# EAGLE design item_2022_Motherboard_04_V8 (EAGLE 7.7.0)

## Sheet 1 of 3
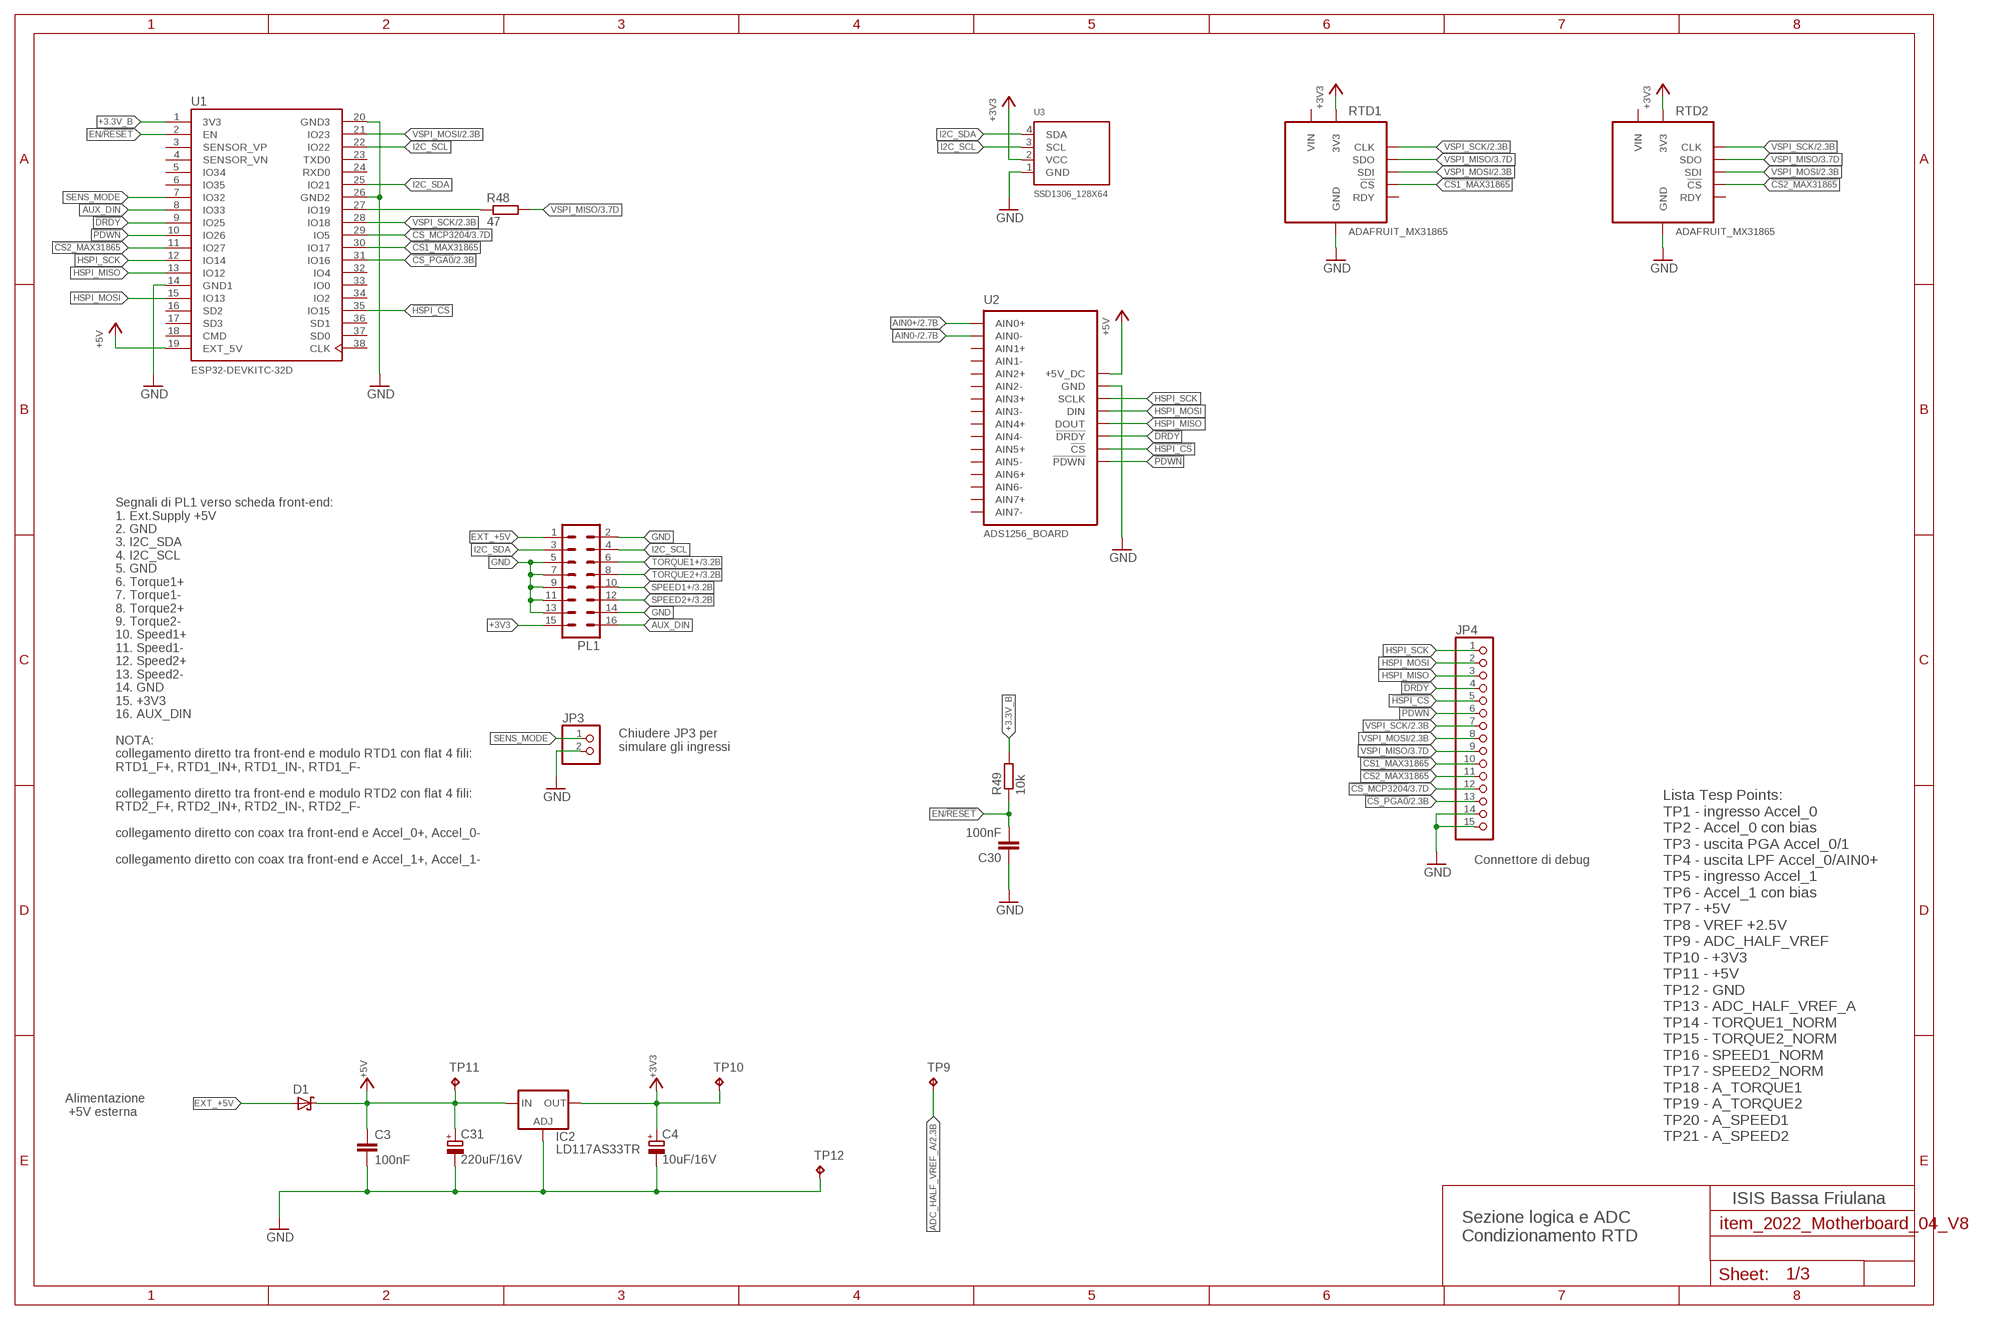
[diagram p0: schematic, sheet 1]

### Parts
C3  100nF  C-EUC0805K  [C0805K]
C4  10uF/16V  CPOL-EUE2.5-6  [E2,5-6]
C30  100nF  C-EUC0805  [C0805]
C31  220uF/16V  CPOL-EUE3.5-10  [E3,5-10]
D1  SCHOTTKY-DIODEDO35-7  [DO35-7]
IC2  LD117AS33TR  [SOT223]
JP3  PINHD-1X2  [1X02]
JP4  PINHD-1X15  [1X15]
PL1  16H  [16H]
R48  47  R-EU_R0805  [R0805]
R49  10k  R-EU_R0805  [R0805]
RTD1  ADAFRUIT_MX31865  [ADAFRUIT_MAX31865]
RTD2  ADAFRUIT_MX31865  [ADAFRUIT_MAX31865]
TP9  TPTP16SQ  [TP16SQ]
TP10  TPTP16SQ  [TP16SQ]
TP11  TPTP16SQ  [TP16SQ]
TP12  TPTP14R  [TP14R]
U1  ESP32-DEVKITC-32D  [MODULE_ESP32-DEVKITC-32D]
U2  ADS1256_BOARD  [ADS1256_BOARD]
U3  SSD1306_128X64  [128X64]

### Nets
!CS1_MAX31865! [digital]: JP4.10 RTD1.P7(!CS!) U1.30(IO17)
!CS2_MAX31865! [digital]: JP4.11 RTD2.P7(!CS!) U1.11(IO27)
!CS_MCP3204! [digital]: JP4.12 U1.29(IO5) ; also sheet 3
!CS_PGA0! [digital]: JP4.13 U1.31(IO16) ; also sheet 2
!DRDY! [digital]: JP4.4 U1.9(IO25) U2.!DRDY!
!HSPI_CS! [digital]: JP4.5 U1.35(IO15) U2.!CS!
!PDWN! [digital]: JP4.6 U1.10(IO26) U2.PDWN(!PDWN!)
+3.3V_B: R49.2 U1.1(3V3)
+3V3 [supply3V3]: C4.+ IC2.4(OUT) PL1.15 RTD1.P3(3V3) RTD2.P3(3V3) TP10.TP U3.2(VCC) ; also sheet 2,3
+5V [supply5V]: C3.1 C31.+ D1.C IC2.3(IN) TP11.TP U1.19(EXT_5V) U2.5V_DC(+5V_DC) ; also sheet 2,3
ADC_HALF_VREF_A [supply]: TP9.TP ; also sheet 2,3
AIN0+ [analog]: U2.AIN0+ ; also sheet 2
AIN0- [analog]: U2.AIN0- ; also sheet 2
AUX_DIN [digital]: PL1.16 U1.8(IO33)
EN/!RESET!: C30.2 R49.1 U1.2(EN)
EXT_+5V [supply5V]: D1.A PL1.1
GND [supply]: C3.2 C4.- C30.1 C31.- IC2.1(ADJ) JP3.2 JP4.14 JP4.15 PL1.2 PL1.5 PL1.7 PL1.9 PL1.11 PL1.13 PL1.14 RTD1.P2(GND) RTD2.P2(GND) TP12.TP U1.14(GND1) U1.20(GND3) U1.26(GND2) U2.GND U3.1(GND) ; also sheet 2,3
HSPI_MISO [digital]: JP4.3 U1.13(IO12) U2.DOUT
HSPI_MOSI [digital]: JP4.2 U1.15(IO13) U2.DIN
HSPI_SCK [digital]: JP4.1 U1.12(IO14) U2.SCLK
I2C_SCL [digital]: PL1.4 U1.22(IO22) U3.3(SCL)
I2C_SDA [digital]: PL1.3 U1.25(IO21) U3.4(SDA)
N$40: R48.1 U1.27(IO19)
SENS_MODE [digital]: JP3.1 U1.7(IO32)
SPEED1+ [analog]: PL1.10 ; also sheet 3
SPEED2+ [analog]: PL1.12 ; also sheet 3
TORQUE1+ [analog]: PL1.6 ; also sheet 3
TORQUE2+ [analog]: PL1.8 ; also sheet 3
VSPI_MISO [digital]: JP4.9 R48.2 RTD1.P5(SDO) RTD2.P5(SDO) ; also sheet 3
VSPI_MOSI [digital]: JP4.8 RTD1.P6(SDI) RTD2.P6(SDI) U1.21(IO23) ; also sheet 2,3
VSPI_SCK [digital]: JP4.7 RTD1.P4(CLK) RTD2.P4(CLK) U1.28(IO18) ; also sheet 2,3
Unconnected: RTD1.P8(RDY) RTD2.P8(RDY) U1.3(SENSOR_VP) U1.4(SENSOR_VN) U1.5(IO34) U1.6(IO35) U1.16(SD2) U1.17(SD3) U1.18(CMD) U1.23(TXD0) U1.24(RXD0) U1.32(IO4) U1.33(IO0) U1.34(IO2) U1.36(SD1) U1.37(SD0) U1.38(CLK) U2.AIN1+ U2.AIN1- U2.AIN2+ U2.AIN2- U2.AIN3+ U2.AIN3- U2.AIN4+ U2.AIN4- U2.AIN5+ U2.AIN5- U2.AIN6+ U2.AIN6- U2.AIN7+ U2.AIN7-

### Notes on the sheet
- Chiudere JP3 per
  simulare gli ingressi
- Connettore di debug
- Segnali di PL1 verso scheda front-end:
  1. Ext.Supply +5V
  2. GND
  3. I2C_SDA
  4. I2C_SCL
  5. GND
  6. Torque1+
  7. Torque1-
  8. Torque2+
  9. Torque2-
  10. Speed1+
  11. Speed1-
  12. Speed2+
  13. Speed2-
  14. GND
  15. +3V3
  16. AUX_DIN
  
  NOTA:
  collegamento diretto tra front-end e modulo RTD1 con flat 4 fili:
  RTD1_F+, RTD1_IN+, RTD1_IN-, RTD1_F-
  
  collegamento diretto tra front-end e modulo RTD2 con flat 4 fili:
  RTD2_F+, RTD2_IN+, RTD2_IN-, RTD2_F-
  
  collegamento diretto con coax tra front-end e Accel_0+, Accel_0-
  
  collegamento diretto con coax tra front-end e Accel_1+, Accel_1-
- Alimentazione
   +5V esterna
- Lista Tesp Points:
  TP1 - ingresso Accel_0
  TP2 - Accel_0 con bias
  TP3 - uscita PGA Accel_0/1
  TP4 - uscita LPF Accel_0/AIN0+
  TP5 - ingresso Accel_1
  TP6 - Accel_1 con bias
  TP7 - +5V
  TP8 - VREF +2.5V
  TP9 - ADC_HALF_VREF
  TP10 - +3V3
  TP11 - +5V
  TP12 - GND
  TP13 - ADC_HALF_VREF_A
  TP14 - TORQUE1_NORM
  TP15 - TORQUE2_NORM
  TP16 - SPEED1_NORM
  TP17 - SPEED2_NORM
  TP18 - A_TORQUE1
  TP19 - A_TORQUE2
  TP20 - A_SPEED1
  TP21 - A_SPEED2
- ISIS Bassa Friulana
- Sezione logica e ADC
  Condizionamento RTD

## Sheet 2 of 3
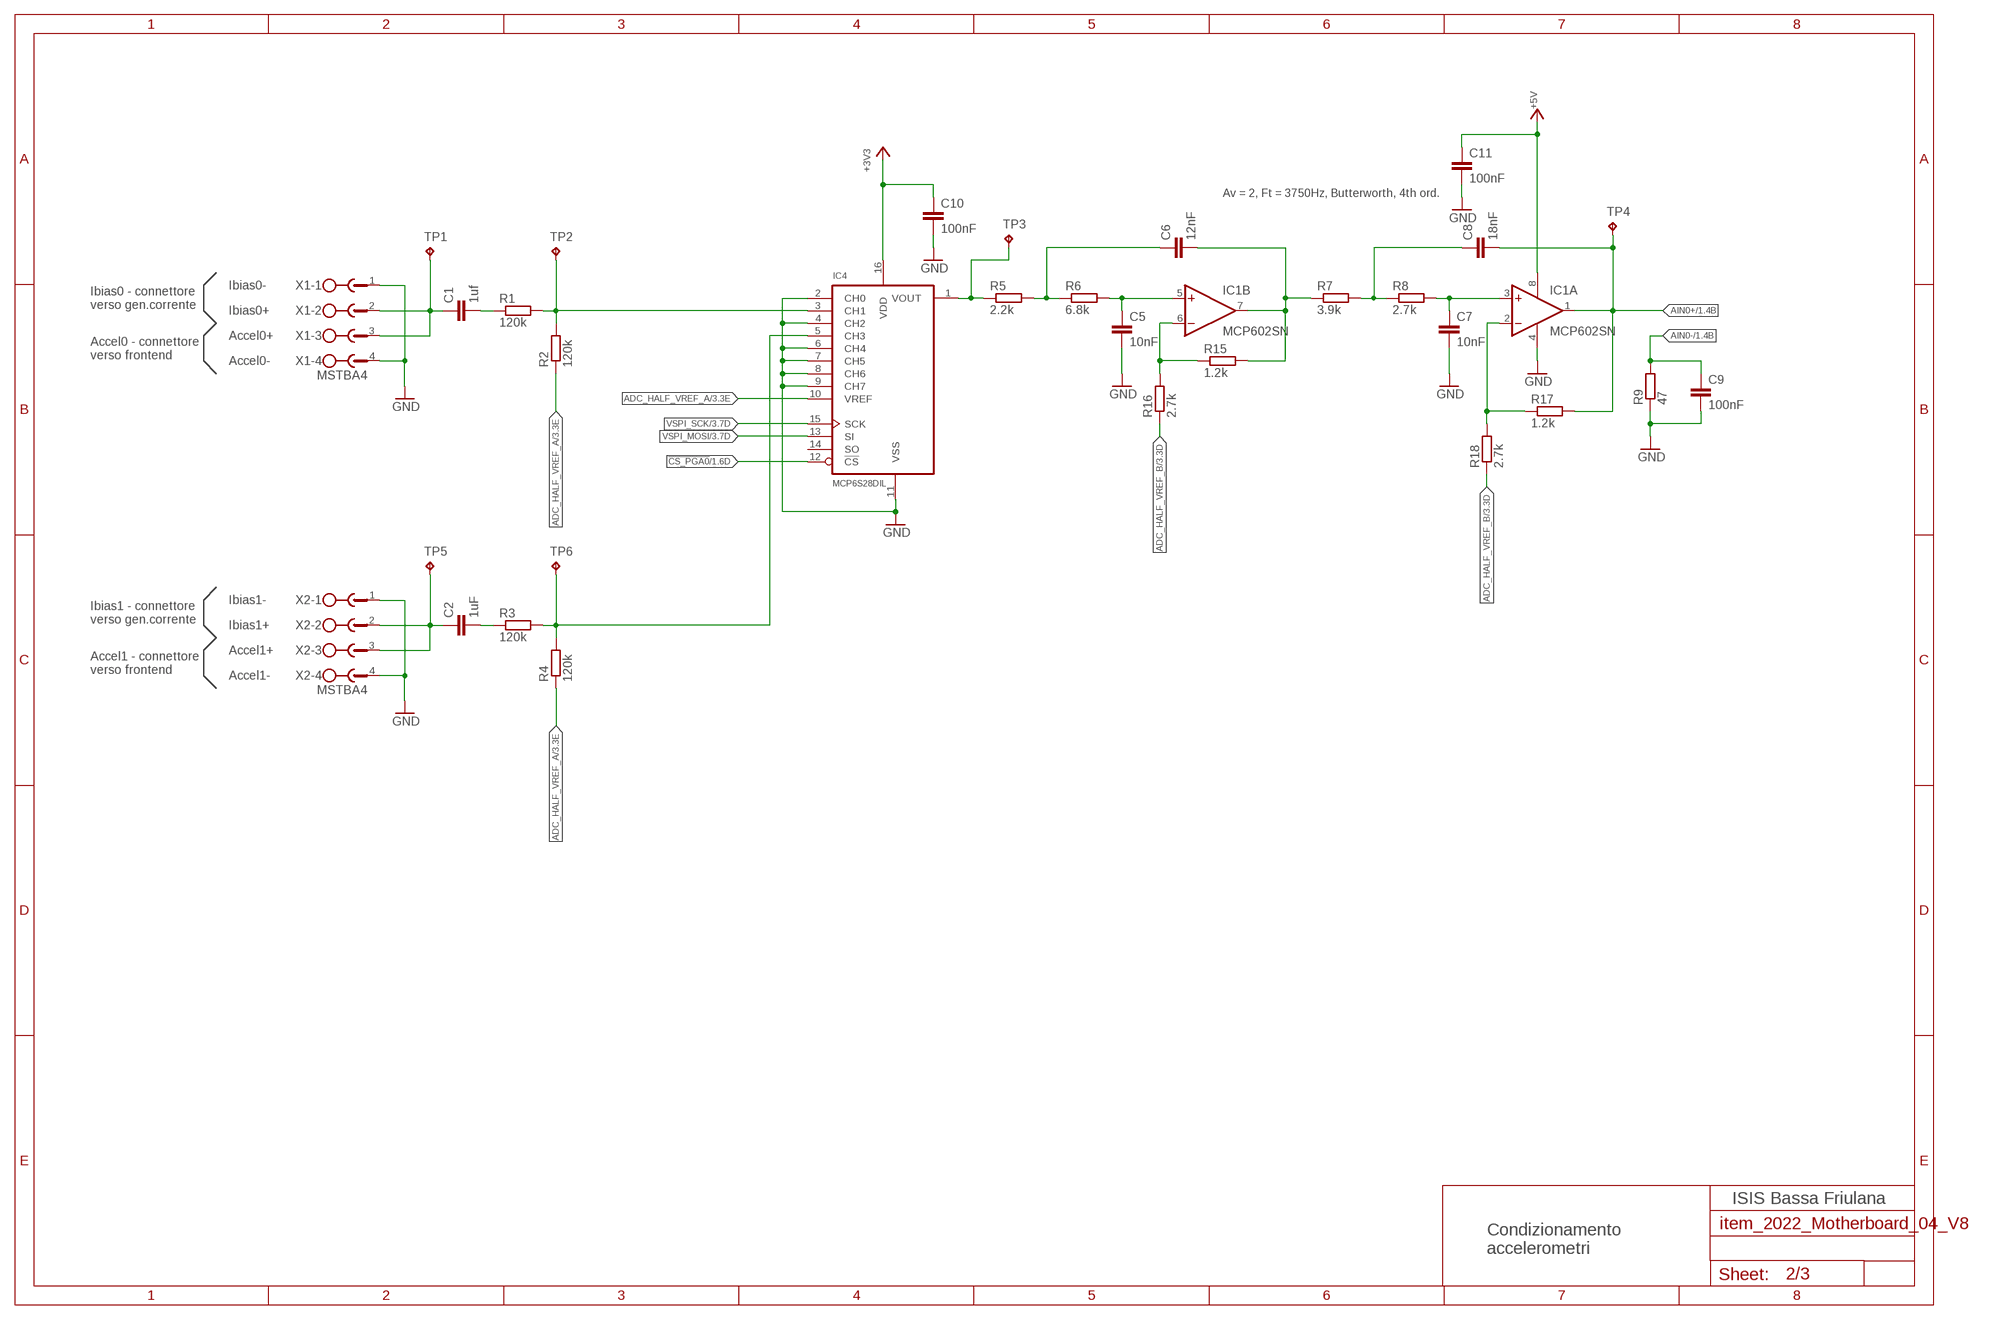
[diagram p1: schematic, sheet 2]

### Parts
C1  1uf  C-EUC1206  [C1206]
C2  1uF  C-EUC1206  [C1206]
C5  10nF  C-EUC0805K  [C0805K]
C6  12nF  C-EUC0805K  [C0805K]
C7  10nF  C-EUC0805K  [C0805K]
C8  18nF  C-EUC0805K  [C0805K]
C9  100nF  C-EUC0805K  [C0805K]
C10  100nF  C-EUC0805K  [C0805K]
C11  100nF  C-EUC0805K  [C0805K]
IC1  MCP602SN  [SO08]
IC4  MCP6S28DIL  [DIL16]
R1  120k  R-EU_R0805  [R0805]
R2  120k  R-EU_R0805  [R0805]
R3  120k  R-EU_R0805  [R0805]
R4  120k  R-EU_R0805  [R0805]
R5  2.2k  R-EU_R0805  [R0805]
R6  6.8k  R-EU_R0805  [R0805]
R7  3.9k  R-EU_R0805  [R0805]
R8  2.7k  R-EU_R0805  [R0805]
R9  47  R-EU_R0805  [R0805]
R15  1.2k  R-EU_R0805  [R0805]
R16  2.7k  R-EU_R0805  [R0805]
R17  1.2k  R-EU_R0805  [R0805]
R18  2.7k  R-EU_R0805  [R0805]
TP1  TPTP14R  [TP14R]
TP2  TPTP14R  [TP14R]
TP3  TPTP14R  [TP14R]
TP4  TPTP14R  [TP14R]
TP5  TPTP14R  [TP14R]
TP6  TPTP14R  [TP14R]
X1  MSTBA4  [MSTBA4]
X2  MSTBA4  [MSTBA4]

### Nets
!CS_PGA0! [digital]: IC4.12(!CS!) ; also sheet 1
+3V3 [supply3V3]: C10.1 IC4.16(VDD) ; also sheet 1,3
+5V [supply5V]: C11.1 IC1.8(P:V+) ; also sheet 1,3
ADC_HALF_VREF_A [supply]: IC4.10(VREF) R2.1 R4.1 ; also sheet 1,3
ADC_HALF_VREF_B: R16.1 R18.1 ; also sheet 3
AIN0+ [analog]: C8.2 IC1.1(A:OUT) R17.2 TP4.TP ; also sheet 1
AIN0- [analog]: C9.1 R9.2 ; also sheet 1
GND [supply]: C5.2 C7.2 C9.2 C10.2 C11.2 IC1.4(P:V-) IC4.2(CH0) IC4.4(CH2) IC4.6(CH4) IC4.7(CH5) IC4.8(CH6) IC4.9(CH7) IC4.11(VSS) R9.1 X1.1 X1.4 X2.1 X2.4 ; also sheet 1,3
N$2 [analog]: C1.1 TP1.TP X1.2 X1.3
N$3 [analog]: C2.1 TP5.TP X2.2 X2.3
N$4 [analog]: IC4.3(CH1) R1.2 R2.2 TP2.TP
N$5 [analog]: IC4.1(VOUT) R5.1 TP3.TP
N$6 [analog]: C1.2 R1.1
N$7: C2.2 R3.1
N$8 [analog]: IC1.6(B:-IN) R15.1 R16.2
N$9 [analog]: C6.1 R5.2 R6.1
N$10 [analog]: C5.1 IC1.5(B:+IN) R6.2
N$11 [analog]: C6.2 IC1.7(B:OUT) R7.1 R15.2
N$12 [analog]: C8.1 R7.2 R8.1
N$13 [analog]: C7.1 IC1.3(A:+IN) R8.2
N$14 [analog]: IC4.5(CH3) R3.2 R4.2 TP6.TP
N$21 [analog]: IC1.2(A:-IN) R17.1 R18.2
VSPI_MOSI [digital]: IC4.13(SI) ; also sheet 1,3
VSPI_SCK [digital]: IC4.15(SCK) ; also sheet 1,3
Unconnected: IC4.14(SO)

### Notes on the sheet
- Av = 2, Ft = 3750Hz, Butterworth, 4th ord.
- Ibias0-
- Ibias0 - connettore 
  verso gen.corrente
- Ibias0+
- Accel0+
- Accel0 - connettore 
  verso frontend
- Accel0-
- Ibias1-
- Ibias1 - connettore 
  verso gen.corrente
- Ibias1+
- Accel1+
- Accel1 - connettore 
  verso frontend
- Accel1-
- ISIS Bassa Friulana
- Condizionamento
  accelerometri

## Sheet 3 of 3
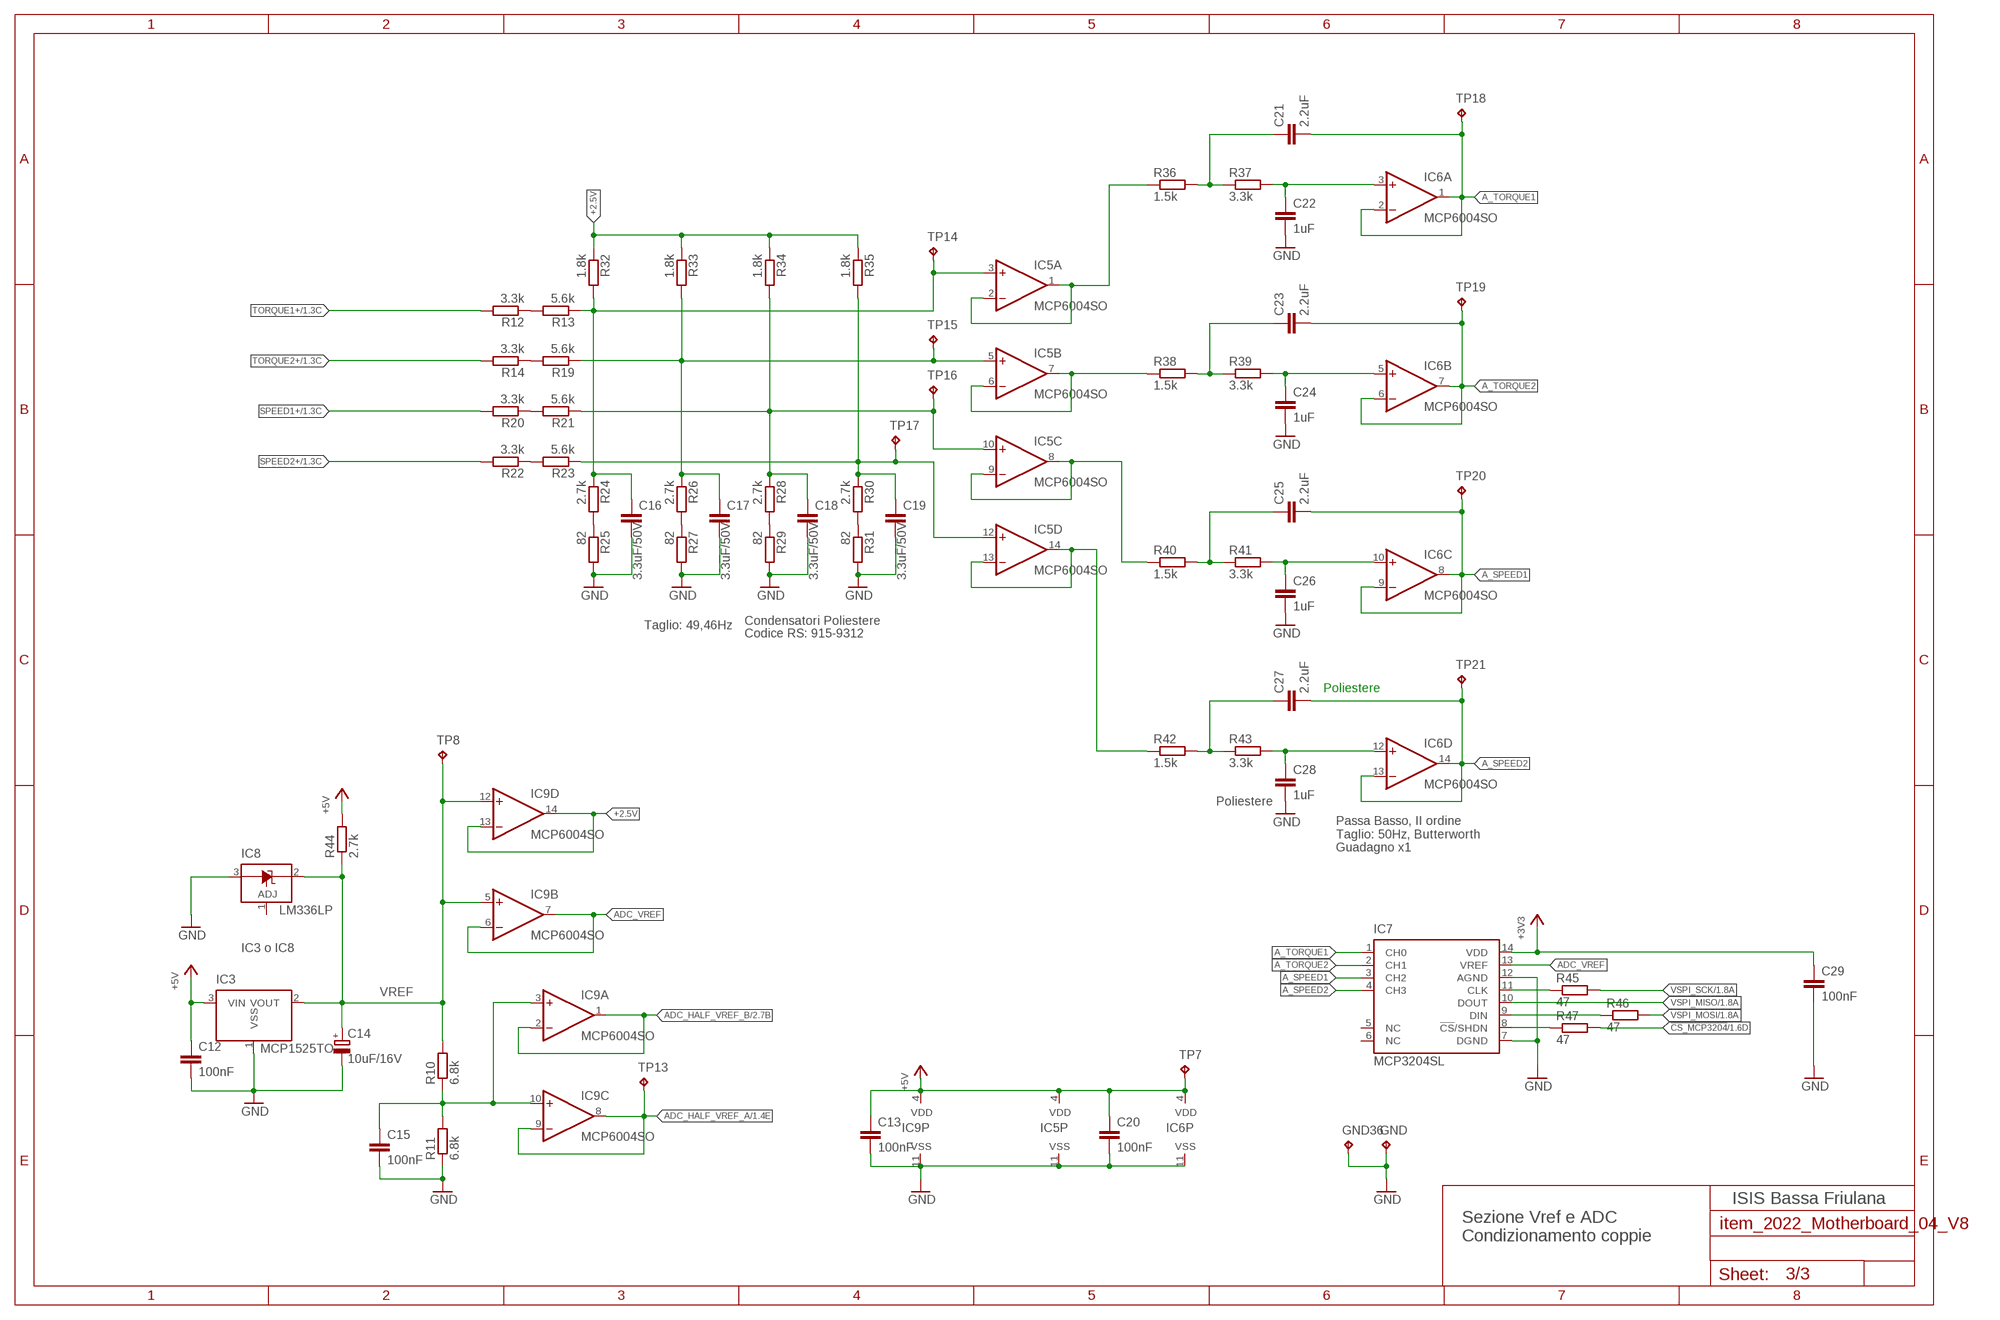
[diagram p2: schematic, sheet 3]

### Parts
C12  100nF  C-EUC0805  [C0805]
C13  100nF  C-EUC0805  [C0805]
C14  10uF/16V  CPOL-EUE2.5-6  [E2,5-6]
C15  100nF  C-EUC0805  [C0805]
C16  3.3uF/50V  C-EUC0805  [C0805]
C17  3.3uF/50V  C-EUC0805  [C0805]
C18  3.3uF/50V  C-EUC0805  [C0805]
C19  3.3uF/50V  C-EUC0805  [C0805]
C20  100nF  C-EUC0805  [C0805]
C21  2.2uF  C-EUC0805  [C0805]
C22  1uF  C-EUC0805  [C0805]
C23  2.2uF  C-EUC0805  [C0805]
C24  1uF  C-EUC0805  [C0805]
C25  2.2uF  C-EUC0805  [C0805]
C26  1uF  C-EUC0805  [C0805]
C27  2.2uF  C-EUC0805  [C0805]
C28  1uF  C-EUC0805  [C0805]
C29  100nF  C-EUC0805  [C0805]
GND  TPTP18SQ  [TP18SQ]
GND36  TPTP18SQ  [TP18SQ]
IC3  MCP1525TO  [TO92]
IC5  MCP6004SO  [SO14]
IC6  MCP6004SO  [SO14]
IC7  MCP3204SL  [SO14]
IC8  LM336LP  [TO92]
IC9  MCP6004SO  [SO14]
R10  6.8k  R-EU_R0805  [R0805]
R11  6.8k  R-EU_R0805  [R0805]
R12  3.3k  R-EU_R0805  [R0805]
R13  5.6k  R-EU_R0805  [R0805]
R14  3.3k  R-EU_R0805  [R0805]
R19  5.6k  R-EU_R0805  [R0805]
R20  3.3k  R-EU_M0805  [M0805]
R21  5.6k  R-EU_R0805  [R0805]
R22  3.3k  R-EU_R0805  [R0805]
R23  5.6k  R-EU_R0805  [R0805]
R24  2.7k  R-EU_R0805  [R0805]
R25  82  R-EU_R0805  [R0805]
R26  2.7k  R-EU_R0805  [R0805]
R27  82  R-EU_R0805  [R0805]
R28  2.7k  R-EU_R0805  [R0805]
R29  82  R-EU_R0805  [R0805]
R30  2.7k  R-EU_R0805  [R0805]
R31  82  R-EU_R0805  [R0805]
R32  1.8k  R-EU_R0805  [R0805]
R33  1.8k  R-EU_R0805  [R0805]
R34  1.8k  R-EU_R0805  [R0805]
R35  1.8k  R-EU_R0805  [R0805]
R36  1.5k  R-EU_R0805  [R0805]
R37  3.3k  R-EU_R0805  [R0805]
R38  1.5k  R-EU_R0805  [R0805]
R39  3.3k  R-EU_R0805  [R0805]
R40  1.5k  R-EU_R0805  [R0805]
R41  3.3k  R-EU_R0805  [R0805]
R42  1.5k  R-EU_R0805  [R0805]
R43  3.3k  R-EU_R0805  [R0805]
R44  2.7k  R-EU_R0805  [R0805]
R45  47  R-EU_R0805  [R0805]
R46  47  R-EU_R0805  [R0805]
R47  47  R-EU_R0805  [R0805]
TP7  TPTP16R  [TP16R]
TP8  TPTP16R  [TP16R]
TP13  TPTP16R  [TP16R]
TP14  TPTP14R  [TP14R]
TP15  TPTP14R  [TP14R]
TP16  TPTP14R  [TP14R]
TP17  TPTP14R  [TP14R]
TP18  TPTP14R  [TP14R]
TP19  TPTP14R  [TP14R]
TP20  TPTP14R  [TP14R]
TP21  TPTP14R  [TP14R]

### Nets
!CS_MCP3204! [digital]: R47.2 ; also sheet 1
+2.5V: IC9.13(D:-IN) IC9.14(D:OUT) R32.1 R33.1 R34.1 R35.1
+3V3 [supply3V3]: C29.1 IC7.14(VDD) ; also sheet 1,2
+5V [supply5V]: C12.1 C13.1 C20.1 IC3.3(VIN) IC5.4(P:VDD) IC6.4(P:VDD) IC9.4(P:VDD) R44.2 TP7.TP ; also sheet 1,2
A_SPEED1: C25.2 IC6.8(C:OUT) IC6.9(C:-IN) IC7.3(CH2) TP20.TP
A_SPEED2: C27.2 IC6.13(D:-IN) IC6.14(D:OUT) IC7.4(CH3) TP21.TP
A_TORQUE1: C21.2 IC6.1(A:OUT) IC6.2(A:-IN) IC7.1(CH0) TP18.TP
A_TORQUE2: C23.2 IC6.6(B:-IN) IC6.7(B:OUT) IC7.2(CH1) TP19.TP
ADC_HALF_VREF_A [supply]: IC9.8(C:OUT) IC9.9(C:-IN) TP13.TP ; also sheet 1,2
ADC_HALF_VREF_B: IC9.1(A:OUT) IC9.2(A:-IN) ; also sheet 2
ADC_VREF [supply]: IC7.13(VREF) IC9.6(B:-IN) IC9.7(B:OUT)
GND [supply]: C12.2 C13.2 C14.- C15.2 C16.2 C17.2 C18.2 C19.2 C20.2 C22.2 C24.2 C26.2 C28.2 C29.2 GND36.TP GND.TP IC3.1(VSS) IC5.11(P:VSS) IC6.11(P:VSS) IC7.7(DGND) IC7.12(AGND) IC8.3(A) IC9.11(P:VSS) R11.1 R25.2 R27.2 R29.2 R31.2 ; also sheet 1,2
N$1: C15.1 IC9.3(A:+IN) IC9.10(C:+IN) R10.1 R11.2
N$15: R12.1 R13.2
N$16: R14.1 R19.2
N$17: R20.1 R21.2
N$18: R22.1 R23.2
N$19: R24.2 R25.1
N$20: C16.1 IC5.3(A:+IN) R13.1 R24.1 R32.2 TP14.TP
N$22: R26.2 R27.1
N$23: R28.2 R29.1
N$24: R30.2 R31.1
N$25: C17.1 IC5.5(B:+IN) R19.1 R26.1 R33.2 TP15.TP
N$26: C18.1 IC5.10(C:+IN) R21.1 R28.1 R34.2 TP16.TP
N$27: C19.1 IC5.12(D:+IN) R23.1 R30.1 R35.2 TP17.TP
N$28: IC5.1(A:OUT) IC5.2(A:-IN) R36.1
N$29: IC5.6(B:-IN) IC5.7(B:OUT) R38.1
N$30: IC5.8(C:OUT) IC5.9(C:-IN) R40.1
N$31: IC5.13(D:-IN) IC5.14(D:OUT) R42.1
N$32: C21.1 R36.2 R37.1
N$33: C22.1 IC6.3(A:+IN) R37.2
N$34: C23.1 R38.2 R39.1
N$35: C24.1 IC6.5(B:+IN) R39.2
N$36: C25.1 R40.2 R41.1
N$37: C26.1 IC6.10(C:+IN) R41.2
N$38: C27.1 R42.2 R43.1
N$39: C28.1 IC6.12(D:+IN) R43.2
N$41: IC7.11(CLK) R45.1
N$42: IC7.9(DIN) R46.1
N$43: IC7.8(!CS!/SHDN) R47.1
SPEED1+ [analog]: R20.2 ; also sheet 1
SPEED2+ [analog]: R22.2 ; also sheet 1
TORQUE1+ [analog]: R12.2 ; also sheet 1
TORQUE2+ [analog]: R14.2 ; also sheet 1
VREF: C14.+ IC3.2(VOUT) IC8.2(C) IC9.5(B:+IN) IC9.12(D:+IN) R10.2 R44.1 TP8.TP
VSPI_MISO [digital]: IC7.10(DOUT) ; also sheet 1
VSPI_MOSI [digital]: R46.2 ; also sheet 1,2
VSPI_SCK [digital]: R45.2 ; also sheet 1,2
Unconnected: IC7.5(NC) IC7.6(NC) IC8.1(ADJ)

### Notes on the sheet
- Taglio: 49,46Hz | Condensatori Poliestere
- Codice RS: 915-9312
- Poliestere
- Poliestere
- Passa Basso, II ordine
  Taglio: 50Hz, Butterworth
  Guadagno x1
- IC3 o IC8
- ISIS Bassa Friulana
- Sezione Vref e ADC
  Condizionamento coppie

## Power pins joined to a net without a drawn wire
VIN: RTD1.P1(VIN) RTD2.P1(VIN)

## Library data of the parts
C1-C3 C5-C11 C30 = rcl:C-EU: CAPACITOR, European symbol
C4 C14 C31 = rcl@1:CPOL-EU: POLARIZED CAPACITOR, European symbol
C12 C13 C15 C20 C29 = rcl_LargePads:C-EU: CAPACITOR, European symbol
C16-C19 = rcl_LargePads:C-EU: CAPACITOR, European symbol; TME_EU: MKS2B043301H00KSSD
C21 C23 C25 C27 = rcl_LargePads:C-EU: CAPACITOR, European symbol; TME_EU: MKS2B042201F00KSSD
C22 C24 C26 C28 = rcl_LargePads:C-EU: CAPACITOR, European symbol; TME_EU: B32529C0105J189
D1 = diode:SCHOTTKY-DIODE: Schottky Diode
GND GND36 TP1-TP21 = testpad:TP: Test pad
IC1 = linear:MCP602: Single Op Amp 2.7V to 6.0V Single Supply CMOS Source: http://ww1.microchip.com/downloads/en/DeviceDoc/21314g.pdf
IC2 = v-reg:LD117A?*: Low drop fixed and adjustable positive voltage regulators 1 A Source: http://www.st.com/stonline/products/literature/ds/7194/ld1117axx.pdf
IC3 = MCP1525_MCP1541:MCP1525: MCP1525 - 2.5V Precision Voltage Reference
IC4 = microchip_opamp:MCP6S28: MCP6S28 Eight channels analog Programmable Gain Amplifier with SPI interface
IC5 IC6 IC9 = MCP6002_MCP6004:MCP6004: MCP6004 - 1 MHz, Low-Power quad Op Amp, Rail-to-Rail Input/Output, Supply Voltage: 1.8V to 6.0V
IC7 = MCP3204_MCP3208:MCP3204: MCP3204 - 2.7V 4-Channel 12-Bit A/D Converters with SPI Serial Interface
IC8 = linear:LM336: 2.5-V INTEGRATED REFERENCE CIRCUITS LM236 Source: http://focus.ti.com/lit/ds/symlink/lm336-2.5.pdf
JP3 = pinhead:PINHD-1X2: PIN HEADER
JP4 = pinhead:PINHD-1X15: PIN HEADER
PL1 = con-harting-h:16H: CONNECTOR; OC_FARNELL: unknown; OC_NEWARK: unknown
R1-R9 R15-R18 R44-R49 = rcl:R-EU_: RESISTOR, European symbol
R10-R14 R19-R43 = rcl_LargePads:R-EU_: RESISTOR, European symbol
RTD1 RTD2 = Adafruit_MAX31865_RTD:ADAFRUIT_MX31865: Adafruit MAX31865 - Adafruit MAX31865 RTD PT100 or PT1000 Amplifier
U1 = ESP32-DEVKITC-32D:ESP32-DEVKITC-32D: Eval Board For Esp-Wroom-32 Check prices <https://pricing.snapeda.com/parts/ESP32-DEVKITC-32D/Espressif%20Systems/view-part?ref=eda>; AVAILABILITY: Warning; DESCRIPTION: WiFi Development Tools (802.11) ESP32 General Development Kit, ESP32-WROOM-32D on the board; MF: Espressif Systems; MP: ESP32-DEVKITC-32D; PACKAGE: None; PRICE: None; PURCHASE-URL: https://pricing.snapeda.com/search/part/ESP32-DEVKITC-32D/?ref=eda
U2 = ADS1256:ADS1256_BOARD: Board 8 Channels - ADS1256 24bit
U3 = ssd1306oled:SSD1306_128X64: OLED Display Board 0.91" 128x64 White I2C - 4 Pins - SSD1306
X1 X2 = con-phoenix-508:MSTBA4: PHOENIX; MF: FARNELL; MPN: 1757268; OC_FARNELL: 3705195; OC_NEWARK: 71C4163

## Net classes
0 default: width 0.305 mm, drill 0.254 mm, clearance 0.305 mm
1 supply: width 0.406 mm, drill 0.305 mm, clearance 0.356 mm to class 0, clearance 0.356 mm
2 digital: width 0.203 mm, drill 0.254 mm, clearance 0.254 mm to class 0, clearance 0.305 mm to class 1, clearance 0.203 mm
3 analog: width 0.508 mm, drill 0.508 mm, clearance 0.406 mm to class 0, clearance 0.406 mm to class 1, clearance 0.406 mm to class 2, clearance 0.406 mm
4 supply5V: width 0.711 mm, drill 0.305 mm, clearance 0.406 mm to class 0, clearance 0.406 mm to class 1, clearance 0.406 mm to class 2, clearance 0.406 mm to class 3, clearance 0.406 mm
5 supply3V3: width 0.559 mm, drill 0.305 mm, clearance 0.356 mm to class 0, clearance 0.356 mm to class 1, clearance 0.356 mm to class 2, clearance 0.356 mm to class 3, clearance 0.356 mm to class 4, clearance 0.356 mm

## Board
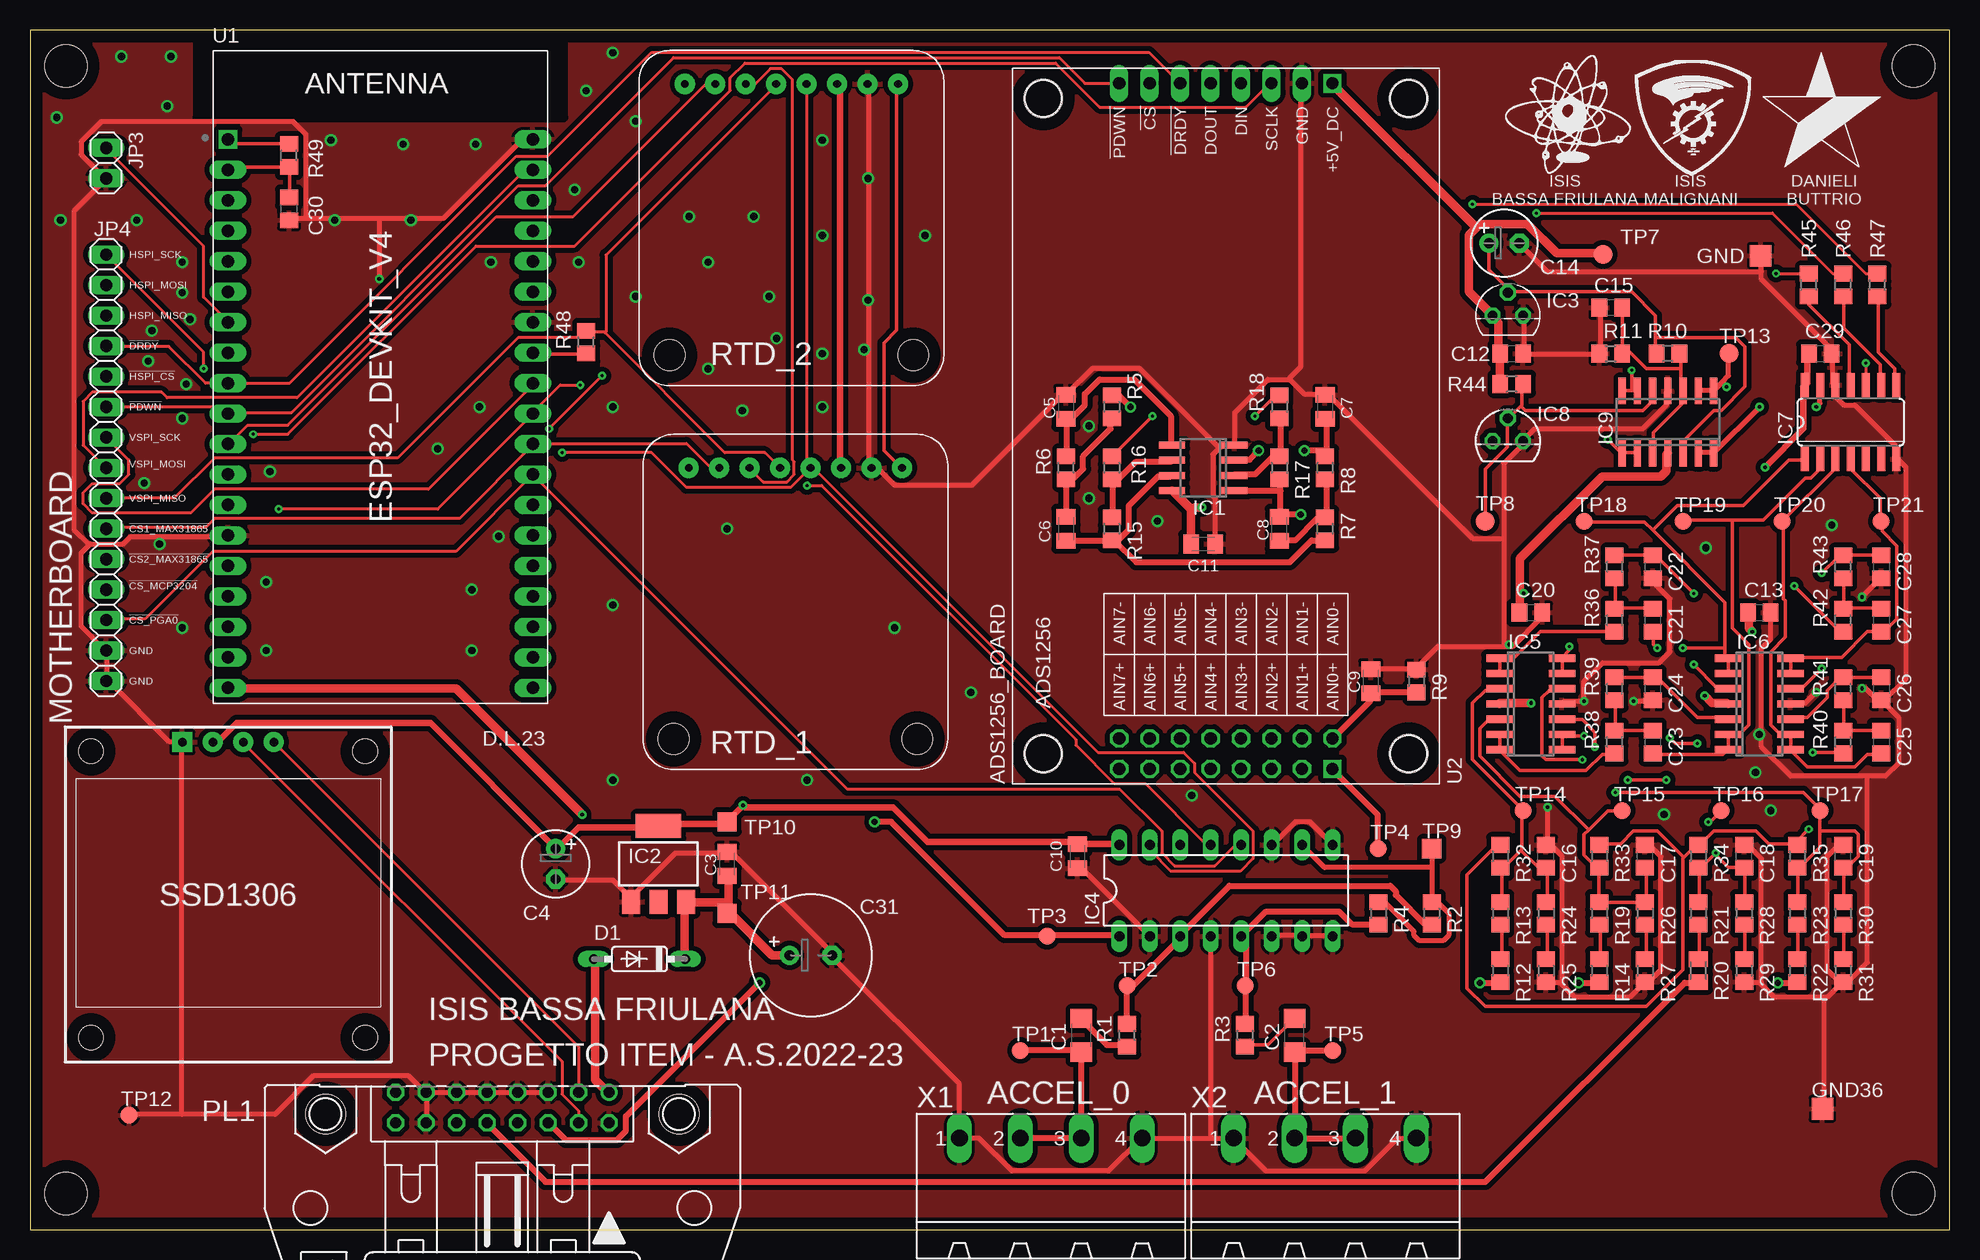
[diagram p3: board, top side]
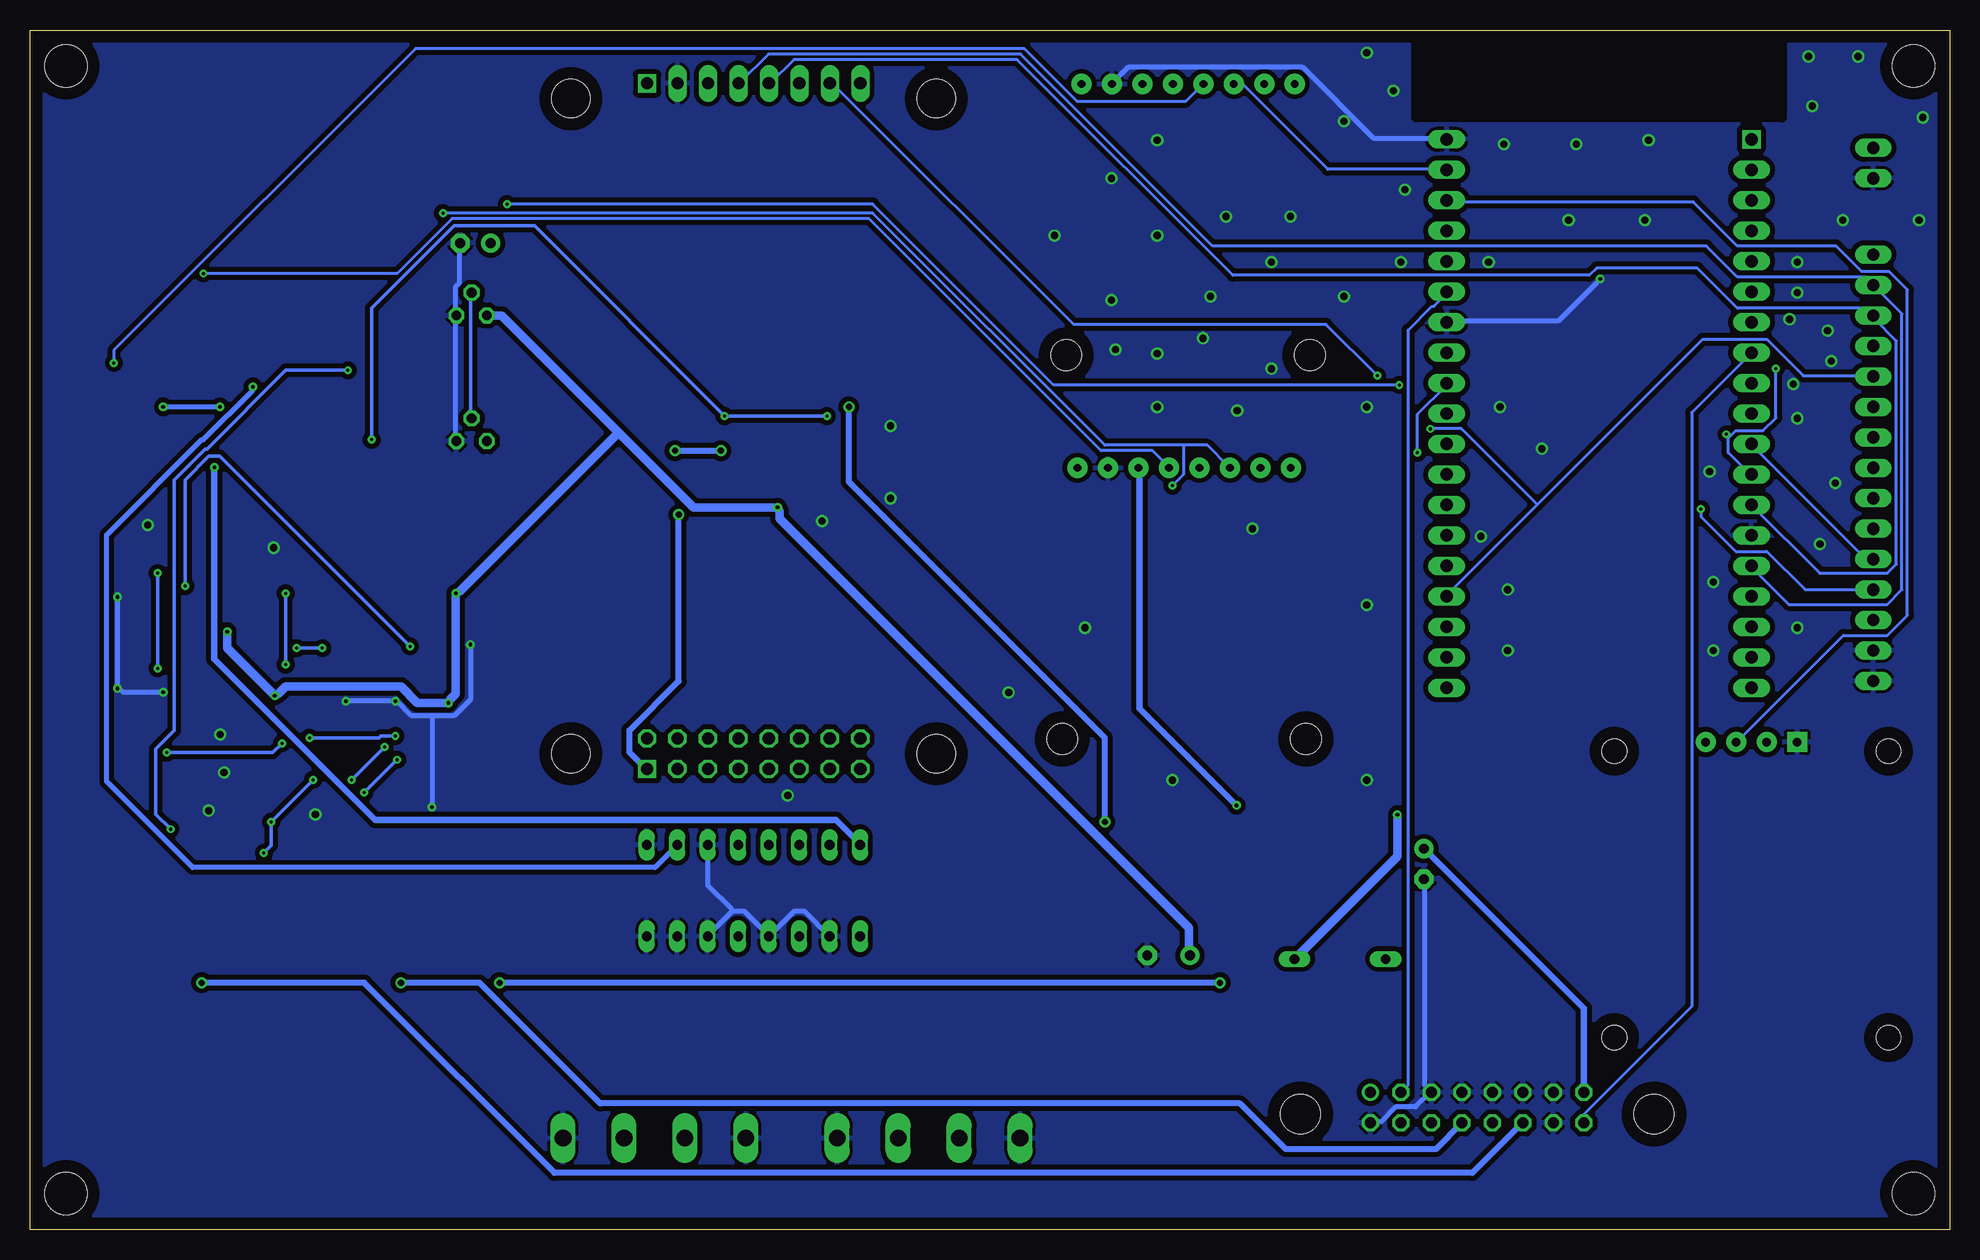
[diagram p4: board, bottom side, seen from below]

Size 160 x 100 mm. Coordinates in mm from the lower left corner, seen from the top.
Outline: 0,0 160,0 160,100 0,100 0,0
Copper layers (1*16): Top 0.035mm / dielectric 1.5mm / Bottom 0.035mm
Design rules "default *": minimum track width 10mil, minimum drill 0.2mm, track to track 8mil, track to pad 8mil, pad to pad 8mil, via to via 8mil, smd to smd 8mil, copper to edge 40mil, drill to drill 8mil, minimum pad ring 10mil, minimum via ring 8mil, stop-mask expansion 4mil, vias tented up to drill 0mil, thermal gap 10mil
Holes 3.5 mm at 157,97 157,3 3,97 3,3
Holes 3.2 mm at 84.45,39.67 114.92,39.67 114.92,94.28 84.45,94.28
tKeepout: area -1.3,99.1 to 161.3,101.6; area -1.3,-1.3 to 1.3,101.6; area -1.3,-1.3 to 161.3,1.3; area 158.8,-1.3 to 161.3,101.6
bKeepout: area -1.3,-1.3 to 1.3,100.3; area -1.3,-1.3 to 161.3,1.3; area 158.8,-1.3 to 161.3,101.6; area -1.3,99.1 to 161.3,101.6
tRestrict: area 14,92.7 to 44.5,100.3
bRestrict: area 14,92.7 to 44.5,100.3

### Footprints (pad centres in the part's own frame; a part is rotated, then mirrored left to right if it is on the bottom)
C1206 = smd 1.6 x 1.8: 1 -1.4,0; 2 1.4,0
C0805K = smd 1.3 x 1.6: 1 -1,0; 2 1,0
E2,5-6 = drill 0.813 pad 1.6: + -1.27,0 | drill 0.813 pad 1.6 octagon: - 1.27,0
C0805 = smd 1.3 x 1.5: 1 -0.95,0; 2 0.95,0
E3,5-10 = drill 0.813 pad 1.6: + -1.778,0 | drill 0.813 pad 1.6 octagon: - 1.778,0
DO35-7 = drill 0.813 long: A 3.81,0; C -3.81,0
TP18SQ = smd 1.8 x 1.8: TP 0,0
SO08 = smd 0.6 x 2.2: 1 -1.905,-2.6; 2 -0.635,-2.6; 3 0.635,-2.6; 4 1.905,-2.6; 5 1.905,2.6; 6 0.635,2.6; 7 -0.635,2.6; 8 -1.905,2.6
SOT223 = smd 1.5 x 2: 1 -2.3,-3.15; 2 0,-3.15; 3 2.3,-3.15 | smd 3.8 x 2: 4 0,3.15
TO92 = drill 0.813 octagon: 1 1.27,0; 2 0,1.905; 3 -1.27,0
DIL16 = drill 0.813 long: 1 -8.89,-3.81; 2 -6.35,-3.81; 3 -3.81,-3.81; 4 -1.27,-3.81; 5 1.27,-3.81; 6 3.81,-3.81; 7 6.35,-3.81; 8 8.89,-3.81; 9 8.89,3.81; 10 6.35,3.81; 11 3.81,3.81; 12 1.27,3.81; 13 -1.27,3.81; 14 -3.81,3.81; 15 -6.35,3.81; 16 -8.89,3.81
SO14 = smd 0.6 x 2.2: 1 -3.81,-2.6; 2 -2.54,-2.6; 3 -1.27,-2.6; 4 0,-2.6; 5 1.27,-2.6; 6 2.54,-2.6; 7 3.81,-2.6; 8 3.81,2.6; 9 2.54,2.6; 10 1.27,2.6; 11 0,2.6; 12 -1.27,2.6; 13 -2.54,2.6; 14 -3.81,2.6
SO14' = smd 0.66 x 2.032: 1 -3.81,-3.073; 2 -2.54,-3.073; 3 -1.27,-3.073; 4 0,-3.073; 5 1.27,-3.073; 6 2.54,-3.073; 7 3.81,-3.073; 8 3.81,3.073; 9 2.54,3.073; 10 1.27,3.073; 11 0,3.073; 12 -1.27,3.073; 13 -2.54,3.073; 14 -3.81,3.073
TO92' = drill 0.813 octagon: 1 -1.27,0; 2 0,1.905; 3 1.27,0
1X02 = drill 1.016 long: 1 -1.27,0; 2 1.27,0
1X15 = drill 1.016 long: 1 -17.78,0; 2 -15.24,0; 3 -12.7,0; 4 -10.16,0; 5 -7.62,0; 6 -5.08,0; 7 -2.54,0; 8 0,0; 9 2.54,0; 10 5.08,0; 11 7.62,0; 12 10.16,0; 13 12.7,0; 14 15.24,0; 15 17.78,0
16H = drill 0.914: 1 -8.89,-1.27 | drill 0.914 octagon: 2 -8.89,1.27; 3 -6.35,-1.27; 4 -6.35,1.27; 5 -3.81,-1.27; 6 -3.81,1.27; 7 -1.27,-1.27; 8 -1.27,1.27; 9 1.27,-1.27; 10 1.27,1.27; 11 3.81,-1.27; 12 3.81,1.27; 13 6.35,-1.27; 14 6.35,1.27; 15 8.89,-1.27; 16 8.89,1.27 | hole 3.302: -14.732,0.533; 14.732,0.533
R0805 = smd 1.3 x 1.5: 1 -0.95,0; 2 0.95,0
M0805 = smd 1.3 x 1.6: 1 -0.95,0; 2 0.95,0
ADAFRUIT_MAX31865 = drill 0.65 pad 1.676: P1 -8.89,-10.16; P2 -6.35,-10.16; P3 -3.81,-10.16; P4 -1.27,-10.16; P5 1.27,-10.16; P6 3.81,-10.16; P7 6.35,-10.16; P8 8.89,-10.16 | hole 2.54: -10.16,12.446; 10.16,12.446
TP14R = smd 1.4 x 1.4: TP 0,0
TP16R = smd 1.6 x 1.6: TP 0,0
TP16SQ = smd 1.6 x 1.6: TP 0,0
MODULE_ESP32-DEVKITC-32D = drill 1.04 square: 1 -12.7,19.76 | drill 1.04 long: 2 -12.7,17.22; 3 -12.7,14.68; 4 -12.7,12.14; 5 -12.7,9.6; 6 -12.7,7.06; 7 -12.7,4.52; 8 -12.7,1.98; 9 -12.7,-0.56; 10 -12.7,-3.1; 11 -12.7,-5.64; 12 -12.7,-8.18; 13 -12.7,-10.72; 14 -12.7,-13.26; 15 -12.7,-15.8; 16 -12.7,-18.34; 17 -12.7,-20.88; 18 -12.7,-23.42; 19 -12.7,-25.96; 20 12.7,19.76; 21 12.7,17.22; 22 12.7,14.68; 23 12.7,12.14; 24 12.7,9.6; 25 12.7,7.06; 26 12.7,4.52; 27 12.7,1.98; 28 12.7,-0.56; 29 12.7,-3.1; 30 12.7,-5.64; 31 12.7,-8.18; 32 12.7,-10.72; 33 12.7,-13.26; 34 12.7,-15.8; 35 12.7,-18.34; 36 12.7,-20.88; 37 12.7,-23.42; 38 12.7,-25.96
ADS1256_BOARD = drill 1.016 square: 5V_DC 27.94,7.62; AIN0+ -29.21,7.62 | drill 1.016 long: !CS! 27.94,-7.62; !DRDY! 27.94,-5.08; DIN 27.94,0; DOUT 27.94,-2.54; GND 27.94,5.08; PDWN 27.94,-10.16; SCLK 27.94,2.54 | drill 1.016 octagon: AIN0- -26.67,7.62; AIN1+ -29.21,5.08; AIN1- -26.67,5.08; AIN2+ -29.21,2.54; AIN2- -26.67,2.54; AIN3+ -29.21,0; AIN3- -26.67,0; AIN4+ -29.21,-2.54; AIN4- -26.67,-2.54; AIN5+ -29.21,-5.08; AIN5- -26.67,-5.08; AIN6+ -29.21,-7.62; AIN6- -26.67,-7.62; AIN7+ -29.21,-10.16; AIN7- -26.67,-10.16
128X64 = drill 0.7 pad 1.676 square: 1 -3.81,12.7 | drill 0.7 pad 1.676: 2 -1.27,12.7; 3 1.27,12.7; 4 3.81,12.7 | hole 2.032: -11.43,11.938; -11.43,-11.938; 11.43,11.938; 11.43,-11.938
MSTBA4 = drill 1.397 long: 1 -7.62,5.08; 2 -2.54,5.08; 3 2.54,5.08; 4 7.62,5.08

### Placement (x,y rotation side)
C1  87.63,16.19 90 top
C2  105.41,16.19 90 top
C3  58.1,30.48 90 top
C4  43.81,30.48 270 top
C5  86.36,68.58 90 top
C6  86.36,58.42 270 top
C7  107.95,68.58 90 top
C8  104.14,58.42 90 top
C9  111.76,45.72 90 top
C10  87.31,31.11 270 top
C11  97.79,57.15 0 top
C12  123.51,73.03 0 top
C13  144.15,51.44 0 top
C14  122.87,82.23 0 top
C15  131.76,76.83 180 top
C16  126.36,31.11 90 top
C17  134.62,31.11 90 top
C18  142.88,31.11 90 top
C19  151.13,31.11 90 top
C20  125.09,51.44 0 top
C21  135.25,50.8 270 top
C22  135.25,55.24 270 top
C23  135.25,40.64 270 top
C24  135.25,45.09 270 top
C25  154.31,40.64 270 top
C26  154.31,45.09 270 top
C27  154.31,50.8 270 top
C28  154.31,55.24 270 top
C29  149.22,73.03 0 top
C30  21.59,85.09 90 top
C31  65.09,22.86 0 top
D1  50.8,22.54 180 top
GND  144.26,81.18 0 top
GND36  149.4,10.06 0 top
IC1  97.79,63.5 90 top
IC2  52.39,30.48 0 top
IC3  123.19,76.2 0 top
IC4  99.69,28.26 0 top
IC5  125.09,43.81 270 top
IC6  144.15,43.81 270 top
IC7  MCP3204SL  [SO14']  151.76,67.31 0 top
IC8  LM336LP  [TO92']  123.19,65.72 0 top
IC9  136.53,67.31 0 top
JP3  6.35,88.9 270 top
JP4  6.35,63.5 270 top
PL1  39.37,10.16 180 top
R1  91.44,16.19 90 top
R2  116.84,26.35 270 top
R3  101.28,16.19 90 top
R4  112.39,26.35 270 top
R5  90.17,68.58 270 top
R6  86.36,63.5 90 top
R7  107.95,58.42 90 top
R8  107.95,63.5 90 top
R9  115.57,45.72 270 top
R10  136.53,73.03 180 top
R11  131.76,73.03 0 top
R12  122.56,21.59 270 top
R13  122.56,26.35 270 top
R14  130.81,21.59 270 top
R15  90.17,58.42 270 top
R16  90.17,63.5 270 top
R17  104.14,63.5 270 top
R18  104.14,68.58 270 top
R19  130.81,26.35 270 top
R20  139.06,21.59 270 top
R21  139.06,26.35 270 top
R22  147.32,21.59 270 top
R23  147.32,26.35 270 top
R24  126.36,26.35 270 top
R25  126.36,21.59 270 top
R26  134.62,26.35 270 top
R27  134.62,21.59 270 top
R28  142.88,26.35 270 top
R29  142.88,21.59 270 top
R30  151.13,26.35 270 top
R31  151.13,21.59 270 top
R32  122.56,31.11 270 top
R33  130.81,31.11 270 top
R34  139.06,31.11 270 top
R35  147.32,31.11 270 top
R36  132.08,50.8 90 top
R37  132.08,55.24 90 top
R38  132.08,40.64 90 top
R39  132.08,45.09 90 top
R40  151.13,40.64 90 top
R41  151.13,45.09 90 top
R42  151.13,50.8 90 top
R43  151.13,55.24 90 top
R44  123.51,70.48 180 top
R45  148.27,78.74 90 top
R46  151.13,78.74 90 top
R47  153.99,78.74 90 top
R48  46.35,73.98 90 top
R49  21.59,89.53 90 top
RTD1  63.8,53.34 180 top
RTD2  63.47,85.34 180 top
TP1  82.55,14.92 0 top
TP2  91.44,20.32 0 top
TP3  84.77,24.45 0 top
TP4  112.39,31.75 0 top
TP5  108.58,14.92 0 top
TP6  101.28,20.32 0 top
TP7  131.13,81.28 0 top
TP8  121.28,59.05 0 top
TP9  116.84,31.75 0 top
TP10  58.1,33.97 0 top
TP11  58.1,26.35 0 top
TP12  8.26,9.53 0 top
TP13  141.6,73.03 0 top
TP14  124.46,34.92 0 top
TP15  132.72,34.92 0 top
TP16  140.97,34.92 0 top
TP17  149.22,34.92 0 top
TP18  129.54,59.05 0 top
TP19  137.79,59.05 0 top
TP20  146.05,59.05 0 top
TP21  154.31,59.05 0 top
U1  29.21,71.12 0 top
U2  100.95,67.61 90 bottom
U3  16.51,27.94 0 top
U$1  [BASSA]  122.24,87.63 0 top
U$2  [UDINE]  133.35,87.63 0 top
U$3  [DANIELI]  144.15,88.58 0 top
X1  85.09,2.54 0 top
X2  107.95,2.54 0 top

### Tracks (layer width: path | path; a pad name or v marks a point on that pad's centre or on a via)
!CS1_MAX31865!
  Top 0.254: JP4.10 6.4,58.52 14.63,58.52 15.39,59.28 35.81,59.28 41.91,65.38 U1.30 41.91,65.53 54.71,65.53 56.69,63.55 57.3,63.55 RTD1.P7
!CS2_MAX31865!
  Top 0.254: RTD2.P7 57,95.4 56.24,95.4 45.26,84.43 38.86,84.43 21.49,67.06 18.14,67.06 16.61,65.53 U1.11
  Bottom 0.254: JP4.11 6.4,55.93 7.01,55.93 16.46,65.38 U1.11
!CS_MCP3204!  (via drill 0.25)
  Top 0.254: v120.24,85.5 147.22,85.5 153.01,79.7 153.92,79.7 R47.2 | v45.87,70.41 44.2,70.41 41.91,68.12 U1.29 41.91,67.97 33.98,60.05 v20.73,60.05
  Bottom 0.254: v120.24,85.5 89.76,85.5 74.68,70.41 v45.87,70.41 | JP4.12 12.04,53.34 15.24,56.54 17.83,56.54 20.73,59.44 v20.73,60.05
!CS_PGA0!
  Top 0.254: U1.31 68.12,36.73 90.83,36.73 94.34,33.22 94.34,31.39 95.4,30.33 98.75,30.33 100.43,32 100.89,32 IC4.12 | U1.31 35.51,56.54 15.24,56.54 9.6,50.9 6.4,50.9 JP4.13 | U1.31
!DRDY!
  Top 0.254: JP4.4 6.4,73.61 11.58,73.61 14.63,70.56 16.46,70.56 U1.9 16.61,70.56 21.64,70.56 40.54,89.46 43.13,89.46 51.82,98.15 93.27,98.15 U2.!DRDY!
!HSPI_CS!  (via drill 0.25)
  Top 0.254: v43.28,66.75 v47.7,71.17
  Bottom 0.254: 34.37,60.43 41.91,52.88 U1.35 | 34.37,60.43 20.57,74.22 15.24,74.22 12.19,71.17 6.4,71.17 JP4.5 | v47.7,71.17 51.97,75.44 73,75.44 92.96,95.4 93.27,95.4 U2.!CS! | v43.28,66.75 40.69,66.75 34.37,60.43
!PDWN!
  Top 0.254: JP4.6 16,68.58 16.46,68.12 U1.10 16.61,68.12 21.79,68.12 40.69,87.02 42.98,87.02 53.65,97.69 85.8,97.69 87.94,95.56 90.68,95.56 U2.PDWN
+2.5V  (via drill 0.25)
  Top 0.305: 133.5,69.95 133.96,69.95 IC9.13 | 133.5,69.95 132.74,69.95 IC9.14 | 137.85,31.01 138.99,32.16 R34.1 139.14,32 140.36,33.22 143.87,33.22 144.93,32.16 147.22,32.16 R35.1 147.22,32.31 v148.28,33.38 | 137.85,31.01 137.77,30.94 137.77,21.64 134.72,18.59 121.31,18.59 119.79,20.12 119.79,29.57 122.22,32 122.53,32 R32.1 | 137.85,31.01 135.64,33.22 133.66,33.22 132.59,32.16 130.91,32.16 R33.1 | v133.5,71.63 133.5,69.95
  Bottom 0.305: v133.5,71.63 138.68,71.63 145.24,65.08 145.39,65.08 147.98,62.48 147.98,41.6 149.5,40.08 149.5,34.59 v148.28,33.38
+3.3V_B
  Top 0.305: R49.2 21.49,90.53 16.92,90.53 16.61,90.83 U1.1
+3V3  (via drill 0.3)
  Top 0.559: C29.1 148.13,73 148.13,70.56 IC7.14 147.83,70.26 147.83,66.75 v144.63,63.55 | IC4.16 90.68,32.16 87.33,32.16 C10.1 87.17,32.31 74.83,32.31 71.93,35.2 59.59,35.2 v59.44,35.36 58.22,34.14 TP10.TP 58.06,33.83 52.58,33.83 52.43,33.68 IC2.4 52.12,33.53 45.72,33.53 44.04,31.85 C4.+ 43.74,31.85 33.38,42.22 17.22,42.22 15.7,40.69 15.24,40.69 U3.2 | RTD1.P3 67.51,63.55 67.51,95.25 67.36,95.4 RTD2.P3
  Bottom 0.559: v144.63,63.55 144.63,47.55 131.22,34.14 92.81,34.14 90.83,32.16 IC4.16 | PL1.15 30.48,18.44 43.74,31.7 C4.+ | v59.44,35.36 67.51,43.43 67.51,63.4 RTD1.P3
+5V  (via drill 0.3)
  Top 0.711: 58.22,27.28 58.22,29.41 C3.1 | 58.22,27.28 58.22,26.36 TP11.TP 58.52,26.21 61.87,22.86 C31.+ | 58.22,27.28 54.71,27.28 IC2.3 54.56,26.98 54.56,22.55 D1.C | v46.02,34.59 35.51,45.11 16.61,45.11 U1.19 | 124.21,53.03 124.21,55.93 131.06,62.79 135.94,62.79 136.4,63.25 136.4,64.62 IC9.4 | 124.21,53.03 124.21,51.51 C20.1 | v143.56,49.84 143.26,50.14 143.26,51.36 C13.1 | v139.6,44.5 140.21,43.89 141.43,43.89 IC6.4 | v125.12,43.89 122.53,43.89 IC5.4 | v124.51,53.03 124.21,53.03 | 96.77,60.05 96.77,57.15 C11.1 | 96.77,60.05 95.25,61.57 IC1.8 | R44.2 122.53,70.56 122.53,73 C12.1 122.38,73.3 122.38,75.59 122.07,75.89 IC3.3 119.94,78.18 119.94,82.91 120.55,83.52 | 120.55,83.52 120.85,83.82 124.82,83.82 127.25,81.38 131.06,81.38 TP7.TP | 120.55,83.52 108.66,95.4 U2.5V_DC | v97.69,60.2 97.08,60.2 96.77,60.05
  Bottom 0.711: v46.02,34.59 46.02,31.09 54.56,22.55 D1.C | v143.56,49.84 143.56,48.46 v139.6,44.5 139.29,44.65 138.68,45.26 129.08,45.26 127.71,43.89 v125.12,43.89 124.97,44.2 124.51,44.65 v124.51,53.03 124.21,53.19 110.95,66.45 | 110.95,66.45 120.7,76.2 IC3.3 | 110.95,66.45 104.7,60.2 v97.69,60.2 97.54,59.89 97.54,59.28 63.4,25.15 63.4,22.86 C31.+
A_SPEED1
  Top 0.305: IC7.3 150.42,64.16 150.42,63.4 146.15,59.13 TP20.TP 146.15,58.98 146.15,52.58 146.3,52.43 146.3,49.38 145.09,48.16 145.09,42.06 145.85,41.3 146.61,41.3 IC6.9 146.76,41.15 146.76,40.08 IC6.8 146.76,39.93 148.13,38.56 152.09,38.56 153.16,39.62 154.23,39.62 C25.2
A_SPEED2
  Top 0.305: IC7.4 151.79,64.16 151.79,63.4 154.23,60.96 154.23,59.13 TP21.TP 154.38,58.98 154.38,58.22 155.6,57 155.6,50.9 154.69,49.99 154.38,49.99 C27.2 154.23,49.84 153.16,49.84 151.03,47.7 146.76,47.7 IC6.14 146.76,47.55 146.76,46.48 IC6.13
A_TORQUE1  (via drill 0.25)
  Top 0.305: 135.25,58.29 141.28,52.27 141.28,48.46 | 135.25,58.29 134.57,58.98 129.54,58.98 TP18.TP | 141.28,48.46 141.28,47.85 141.43,47.7 IC6.1 141.58,47.55 141.58,46.48 IC6.2 | v135.64,48.46 135.33,48.77 135.33,49.84 C21.2 | 141.28,48.46 v137.77,48.46 | 135.25,58.29 137.31,60.35 142.8,60.35 146.61,64.16 147.83,64.16 IC7.1
  Bottom 0.305: v137.77,48.46 v135.64,48.46
A_TORQUE2
  Top 0.305: C23.2 135.33,39.62 141.12,39.62 141.43,39.93 IC6.7 141.58,40.08 141.58,41.15 IC6.6 141.73,41.15 142.34,41.15 143.26,42.06 143.26,48.77 141.88,50.14 141.88,59.13 | 141.88,59.13 144.47,59.13 147.98,62.64 148.44,62.64 149.2,63.4 149.2,64.16 IC7.2 | 141.88,59.13 137.92,59.13 TP19.TP
ADC_HALF_VREF_A  (via drill 0.3)
  Top 0.406: 141.05,70.64 140.36,69.95 IC9.8 140.21,69.95 139.14,69.95 IC9.9 | 141.05,70.64 141.58,71.17 141.58,73 TP13.TP | R4.1 112.47,27.28 112.93,27.28 115.37,24.84 115.37,24.54 115.82,24.08 117.81,24.08 118.26,24.54 118.26,26.36 117.35,27.28 116.89,27.28 R2.1 116.89,27.43 116.89,30.18 | 116.89,30.18 116.89,31.7 TP9.TP | 116.89,30.18 107.9,30.18 106.07,32 IC4.10 | v141.43,70.26 141.05,70.64
  Bottom 0.406: v141.43,70.26 141.43,69.95 145.54,65.84 145.69,65.84 153.62,57.91 153.62,37.34 146.46,30.18 107.9,30.18 106.07,32 IC4.10
ADC_HALF_VREF_B  (via drill 0.25)
  Top 0.305: IC9.2 133.96,64.77 132.74,64.77 IC9.1 132.59,64.77 v131.52,65.84 | v93.57,67.82 90.22,64.47 R16.1 | v102.11,67.82 103.78,69.49 104.09,69.49 R18.1
  Bottom 0.305: v93.57,67.82 v102.11,67.82 117.96,83.67 124.66,83.67 131.52,76.81 v131.52,65.84
ADC_VREF  (via drill 0.3)
  Top 0.406: v148.9,68.58 149.2,68.89 149.2,70.26 IC7.13 | v144.17,68.58 140.36,64.77 IC9.7 140.21,64.77 139.14,64.77 IC9.6
  Bottom 0.406: v144.17,68.58 v148.9,68.58
AIN0+  (via drill 0.51)
  Top 0.508: 104.24,61.57 104.24,59.44 C8.2 104.39,59.59 v105.92,59.59 | 104.24,61.57 104.24,62.48 R17.2 | 104.24,61.57 100.43,61.57 IC1.1 | TP4.TP 112.32,31.85 112.32,34.59 108.66,38.25 U2.AIN0+
  Bottom 0.508: v105.92,59.59 105.92,45.72 110.03,41.6 110.03,39.78 108.66,38.41 U2.AIN0+
AIN0-
  Top 0.508: R9.2 115.52,44.81 111.86,44.81 C9.1 111.71,44.5 111.71,44.04 108.66,41 U2.AIN0-
AUX_DIN
  Bottom 0.254: PL1.16 30.48,9.6 21.49,18.59 21.49,68.12 16.61,73 U1.8
EN/!RESET!
  Top 0.305: C30.2 21.64,86.11 21.64,88.54 R49.1 21.49,88.54 16.76,88.54 16.61,88.39 U1.2
EXT_+5V
  Top 0.711: D1.A 47.09,22.4 47.09,12.5 48.16,11.43 PL1.1
GND  (via drill 0.3, 0.6)
  Top 0.406: IC4.11 103.63,32.16 105.46,33.98 106.68,33.98 108.51,32.16 IC4.9 | IC4.6 103.63,24.54 105.92,24.54 IC4.7 106.22,24.54 108.51,24.54 IC4.8 | C10.2 87.33,30.02 87.78,30.02 93.27,24.54 IC4.2 | 98.45,7.62 X1.4 92.66,7.62 89.92,4.88 81.84,4.88 79.1,7.62 X1.1 77.42,7.77 77.42,12.19 66.9,22.71 C31.- 66.75,22.86 66.75,23.16 58.67,31.24 58.22,31.24 C3.2 58.06,31.39 53.8,31.39 50.14,27.74 50.14,27.43 IC2.1 49.99,27.74 48.62,29.11 43.89,29.11 C4.- | 98.45,7.62 X2.1 100.43,7.47 103.02,4.88 111.25,4.88 114,7.62 X2.4 | 98.45,7.62 98.45,24.38 IC4.4 | 5.03,57.15 7.77,57.15 8.38,57.76 16.46,57.76 U1.14 | 5.03,57.15 4.27,56.39 4.27,50.29 6.25,48.31 JP4.14 6.4,48.16 6.4,45.72 JP4.15 6.55,45.72 11.58,40.69 12.65,40.69 U3.1 12.65,40.54 12.65,9.6 | 12.65,9.6 20.42,9.6 23.62,12.8 31.55,12.8 32.92,11.43 PL1.13 | 12.65,9.6 8.38,9.6 TP12.TP | PL1.14 33.07,8.99 33.07,11.28 PL1.13 | PL1.13 PL1.11 PL1.9 PL1.7 PL1.5 | 153.16,37.8 154.69,37.8 155.75,38.86 155.75,42.67 154.38,44.04 C26.2 | 153.16,37.8 146.76,37.8 144.32,40.23 144.32,48.46 145.09,49.23 145.09,51.36 C13.2 | v152.71,52.73 154.23,54.25 C28.2 | v152.71,45.11 153.01,45.11 153.92,44.2 154.23,44.2 C26.2 | v148.9,44.81 147.98,43.89 146.76,43.89 IC6.11 | 144.17,20.57 142.95,20.57 R29.2 | 144.17,20.57 145.39,19.36 149.5,19.36 | 149.5,19.36 149.81,19.36 151.03,20.57 R31.2 | C18.2 142.95,32 143.26,32 144.32,30.94 144.32,20.57 144.17,20.57 | C19.2 151.03,32 150.72,32 149.81,31.09 149.81,21.64 150.88,20.57 R31.2 | 149.5,19.36 149.5,10.21 GND36.TP | 153.16,37.8 153.16,22.25 151.64,20.73 151.18,20.73 R31.2 | 144.32,79.86 144.32,79.25 150.11,73.46 150.11,73.15 C29.2 150.27,73 150.27,70.56 150.42,70.41 IC7.12 150.57,70.26 150.57,69.34 151.18,68.73 152.09,68.73 155.45,65.38 155.45,64.31 IC7.7 155.75,64.16 156.36,63.55 156.36,45.87 154.53,44.04 C26.2
  Top 0.406: 144.32,79.86 144.32,81.08 GND.TP | 127.56,20.57 126.49,20.57 R25.2 | 127.56,20.57 128.78,19.36 133.35,19.36 134.57,20.57 R27.2 134.72,20.73 135.03,20.73 135.94,21.64 135.94,31.09 135.03,32 134.72,32 C17.2 | 127.56,20.57 127.71,20.57 127.71,31.09 126.8,32 126.49,32 C16.2 126.49,32.16 v126.49,35.2 | v133.66,44.04 135.18,44.04 C24.2 | IC5.11 127.71,43.89 127.86,44.04 v129.54,44.04 129.54,45.72 131.06,47.24 135.79,47.24 136.7,48.16 136.7,52.58 135.33,53.95 135.33,54.25 C22.2 | C9.2 111.86,46.79 115.52,46.79 R9.1 115.67,46.94 117.35,48.62 122.83,48.62 | 122.83,48.62 123.29,48.62 | 123.29,48.62 123.6,48.62 126.03,51.05 126.03,51.36 C20.2 | C15.2 130.91,76.81 130.91,73.15 R11.1 130.76,73 124.66,73 C12.2 124.51,73.15 124.51,76.2 IC3.1 | IC9.11 136.4,69.8 136.4,68.73 134.42,66.75 125.42,66.75 124.51,65.84 IC8.3 124.51,65.53 122.83,63.86 122.83,57.61 | 122.83,57.61 122.83,48.62 | v123.29,48.77 123.29,48.62 | 144.32,79.86 126.49,79.86 124.21,82.14 C14.- | 29.11,84.28 34.44,84.28 41,90.83 41.91,90.83 U1.20 | 29.11,84.28 23.01,84.28 | 23.01,84.28 21.64,84.28 C30.1 | 23.01,84.28 23.01,91.29 21.95,92.35 5.94,92.35 4.27,90.68 4.27,89.61 6.25,87.63 JP3.2 6.25,87.48 3.66,84.89 3.66,58.37 4.88,57.15 5.03,57.15 | 29.11,84.28 v29.11,79.25 | 99.14,65.15 99.36,65.38 100.28,65.38 IC1.4 100.43,65.53 100.43,68.12 103.17,70.87 105,70.87 | 99.14,65.15 98.6,64.62 98.6,61.11 98.75,60.96 98.75,57.15 C11.2 | 99.14,65.15 92.51,71.78 88.54,71.78 86.41,69.65 C5.2 86.26,69.49 85.95,69.49 78.49,62.03 72.08,62.03 70.71,63.4 70.26,63.4 RTD1.P2 69.95,63.55 69.95,95.4 RTD2.P2 | 105,70.87 106.22,69.65 107.9,69.65 C7.2 108.05,69.49 108.36,69.49 120.24,57.61 122.83,57.61
  Top 0.406: U2.GND 105.92,95.4 105.92,71.93 105,71.02 105,70.87
  Bottom 0.406: IC4.2 93.42,24.54 95.4,26.52 96.32,26.52 98.3,24.54 IC4.4 98.45,24.54 100.43,26.52 101.5,26.52 | 101.5,26.52 103.48,24.54 IC4.6 | IC4.11 103.48,32 103.48,28.65 101.5,26.67 101.5,26.52 | PL1.2 48.16,8.99 47.4,8.99 46.18,10.21 44.5,10.21 43.28,11.43 PL1.5 43.28,11.58 43.74,12.04 43.74,29.11 C4.- | v152.71,52.73 v152.71,45.11 152.55,45.11 152.25,44.81 v148.9,44.81 | v133.66,44.04 v129.54,44.04 129.39,44.04 128.17,42.82 126.49,42.82 | C14.- 124.21,82.14 124.21,78.94 124.51,78.64 124.51,76.2 IC3.1 124.51,76.05 124.51,65.84 IC8.3 | 126.49,42.82 124.66,42.82 123.29,44.2 v123.29,48.77 | 126.49,42.82 v126.49,35.2 | v29.11,79.25 32.61,75.74 41.91,75.74 U1.26 | U1.20 41.91,90.98 48.01,90.98 53.95,96.93 68.43,96.93 69.8,95.56 RTD2.P2
  other vias: 66.04,68.58 59.37,68.26 48.58,68.58 48.58,52.07 48.58,37.47 64.77,37.47 78.42,44.77 37.47,68.58 33.97,65.09 19.68,53.98 12.7,50.16 19.68,48.26 36.83,53.34 36.83,48.26 58.1,58.42 72.07,50.16 20,63.18 10.79,57.15 25.4,84.14 31.75,84.14 38.42,80.64 45.72,80.64 56.52,80.64 54.93,84.45 60.33,84.45 50.48,77.79 61.59,77.79 69.85,77.47 74.61,82.87 69.85,87.63 7.62,97.79 11.75,97.79 11.43,93.66 2.22,92.71 2.54,84.14 8.89,84.14 25.08,90.81 31.11,90.49 37.15,90.49 45.4,86.68 50.48,92.39 46.35,94.93 48.58,98.11 13.34,75.88 12.7,78.11 12.7,80.64 10.16,74.93 9.84,72.39 13.02,70.48 12.7,67.63 9.53,62.23 39.05,57.78 56.52,71.75 62.23,74.3 66.04,73.03 69.53,73.34 66.04,82.87 66.04,90.81 88.27,66.99 88.27,60.96 93.98,59.05 150.18,58.74 139.7,56.83 96.84,36.2 136.21,34.61 143.83,38.1 144.15,41.27 145.1,34.92
  pour Bottom (isolate 0.406): -2.54,102.87 162.88,102.87 162.88,-3.49 -2.54,-3.49
  pour Top (isolate 0.406): -4.45,103.19 162.56,103.19 162.56,-2.86 -4.45,-2.86
HSPI_MISO
  Bottom 0.254: U1.13 16.46,60.35 10.82,54.71 5.18,54.71 4.42,55.47 4.42,74.07 6.25,75.89 6.25,76.2 JP4.3 6.4,76.2 7.01,76.81 17.68,76.81 21.03,80.16 29.41,80.16 30.02,79.55 59.74,79.55 77.72,97.54 96.32,97.54 98.3,95.56 U2.DOUT
HSPI_MOSI
  Bottom 0.254: U1.15 16.46,55.17 13.41,52.12 5.18,52.12 3.96,53.34 3.96,76.35 JP4.2 7.01,79.4 17.68,79.4 20.27,81.99 61.42,81.99 77.42,97.99 98.45,97.99 100.89,95.56 U2.DIN
HSPI_SCK  (via drill 0.25)
  Top 0.254: JP4.1 14.48,73.15 v14.48,71.78 | v18.59,66.29 21.49,66.29 37.19,81.99 45.41,81.99 58.37,94.94 58.37,96.01 59.59,97.23 85.5,97.23 89.15,93.57 101.35,93.57 103.17,95.4 103.48,95.4 U2.SCLK
  Bottom 0.254: v14.48,71.78 14.48,67.67 15.54,66.6 17.83,66.6 18.36,66.06 | 18.36,66.06 18.44,65.99 18.44,64.77 16.61,62.94 U1.12 | 18.36,66.06 v18.59,66.29
I2C_SCL
  Top 0.254: PL1.4 45.72,9.91 44.35,11.28 44.35,14.02 17.83,40.54 U3.3
  Bottom 0.254: U1.22 41.91,85.65 21.34,85.65 17.68,81.99 9.45,81.99 7.32,79.86 5.03,79.86 3.5,78.33 3.5,51.21 5.18,49.53 8.84,49.53 17.68,40.69 U3.3
I2C_SDA
  Top 0.254: PL1.3 45.72,15.24 U3.4
  Bottom 0.254: PL1.3 45.11,12.04 45.11,74.98 43.13,76.96 42.98,76.96 41.91,78.03 U1.25
N$1
  Top 0.305: C15.1 132.74,76.81 132.74,73.15 R11.2 132.89,73.15 133.35,73.15 134.72,71.78 137.62,71.78 | 137.62,71.78 137.62,70.1 137.77,69.95 IC9.10 137.77,69.8 137.77,68.89 135.33,66.45 135.33,64.77 IC9.3 | 137.62,71.78 137.62,73 R10.1
N$2
  Top 0.508: TP1.TP 82.6,14.94 87.63,14.94 C1.1 X1.3 X1.2
N$3
  Top 0.508: TP5.TP 108.51,14.94 105.46,14.94 C2.1 105.46,14.63 105.46,7.62 X2.2 X2.3
N$4
  Top 0.508: R1.2 TP2.TP 91.59,20.42 92.05,20.42 95.86,24.23 IC4.3 95.86,24.54 99.97,28.65 113.39,28.65 113.84,28.19 113.84,27.89 116.28,25.45 116.74,25.45 R2.2
N$5  (via drill 0.51)
  Top 0.508: IC4.1 90.68,24.54 84.89,24.54 TP3.TP 84.58,24.54 81.23,24.54 71.78,33.98 v70.41,33.98 | v91.75,68.58 90.83,69.49 90.22,69.49 R5.1
  Bottom 0.508: v91.75,68.58 91.75,62.33 70.41,41 v70.41,33.98
N$6
  Top 0.508: R1.1 91.44,15.39 89.76,15.39 87.63,17.53 C1.2
N$7
  Top 0.305: R3.1 101.35,15.39 103.17,15.39 105.31,17.53 C2.2
N$8
  Top 0.508: R15.1 90.22,59.44 90.22,62.48 R16.2 90.37,62.64 90.83,62.64 92.2,64.01 95.1,64.01 IC1.6
N$9
  Top 0.508: C6.1 86.41,59.44 86.41,62.48 R6.1 86.56,62.64 87.02,62.64 87.78,63.4 87.78,64.47 90.07,66.75 90.07,67.51 R5.2
N$10
  Top 0.508: R6.2 86.41,64.47 86.41,67.51 C5.1 86.56,67.36 87.94,68.73 87.94,69.65 89.15,70.87 92.05,70.87 95.1,67.82 95.1,65.53 IC1.5
N$11
  Top 0.508: R15.2 90.07,57.45 86.41,57.45 C6.2 | R7.1 107.9,57.45 106.83,57.45 105,55.63 92.2,55.63 90.37,57.45 R15.2 | IC1.7 95.1,62.79 94.03,62.79 91.59,60.35 91.59,58.37 90.68,57.45 R15.2
N$12
  Top 0.508: R8.1 108.05,62.48 108.05,59.44 R7.2 107.75,59.28 107.29,59.28 105.46,57.45 104.24,57.45 C8.1
N$13  (via drill 0.51)
  Top 0.508: C7.1 108.05,67.51 108.05,64.47 R8.2 107.9,64.92 v106.22,64.92 | v102.41,64.92 101.65,64.16 100.43,64.16 IC1.3
  Bottom 0.508: v106.22,64.92 v102.41,64.92
N$14
  Top 0.508: R3.2 101.35,17.22 101.35,20.27 TP6.TP 101.35,20.57 101.35,23.93 101.04,24.23 IC4.5 101.04,24.54 103.02,26.52 109.12,26.52 110.19,25.45 112.32,25.45 R4.2
N$15
  Top 0.305: R12.1 122.68,22.55 122.68,25.3 R13.2
N$16
  Top 0.305: R14.1 130.91,22.55 130.91,25.3 R19.2
N$17
  Top 0.305: R21.2 139.14,25.3 139.14,22.55 R20.1
N$18
  Top 0.305: R22.1 147.37,22.55 147.37,25.3 R23.2
N$19
  Top 0.305: R25.1 126.49,22.55 126.49,25.3 R24.2
N$20
  Top 0.305: R24.1 126.49,27.43 126.49,30.02 C16.1 126.34,30.18 125.73,30.18 124.28,31.62 | 124.28,31.62 122.68,30.02 R32.2 122.68,29.87 122.68,27.43 R13.1 | 124.28,31.62 124.36,31.7 124.36,34.9 TP14.TP 124.36,35.05 120.24,39.17 120.24,43.89 121.31,44.96 122.38,44.96 IC5.3
N$21
  Top 0.508: R18.2 104.24,67.51 104.24,64.47 R17.1 103.94,64.31 103.48,64.31 102.11,62.94 100.43,62.94 IC1.2
N$22
  Top 0.305: R27.1 134.72,22.55 134.72,25.3 R26.2
N$23
  Top 0.305: R29.1 142.95,22.55 142.95,25.3 R28.2
N$24
  Top 0.305: R31.1 151.18,22.55 151.18,25.3 R30.2
N$25
  Top 0.305: C17.1 134.72,30.02 134.72,27.43 R26.1 134.57,27.28 130.91,27.28 R19.1 130.76,27.43 130.76,29.87 R33.2 130.76,30.02 129.54,31.24 129.54,32.92 129.92,33.3 | 129.92,33.3 131.52,34.9 132.59,34.9 TP15.TP | 129.92,33.3 127.1,36.12 124.21,36.12 120.85,39.47 120.85,41.76 121.61,42.52 122.38,42.52 IC5.5
N$26  (via drill 0.25)
  Top 0.305: R28.1 142.95,27.43 142.95,30.02 C18.1 142.8,30.18 141.58,30.18 140.51,31.24 v140.51,31.39 139.14,30.02 R34.2 139.14,29.87 139.14,27.43 R21.1 | v139.9,33.98 140.06,33.98 140.97,34.9 TP16.TP | v130.45,40.23 130.45,41.45 129.39,42.52 127.71,42.52 IC5.10 | v136.4,37.49 v133.2,37.49
  Bottom 0.305: v140.51,31.39 139.9,32 v139.9,33.98 v136.4,37.49 | v133.2,37.49 v130.45,40.23
N$27  (via drill 0.25)
  Top 0.305: R30.1 151.18,27.43 151.18,30.02 C19.1 151.33,30.02 152.4,31.09 152.4,32.92 152.09,33.22 149.2,33.22 | 149.2,33.22 149.2,31.85 147.37,30.02 R35.2 147.37,29.87 147.37,27.43 R23.1 | 149.2,33.22 149.2,34.9 TP17.TP 149.2,35.05 147.83,36.42 v132.13,36.42 | v129.39,39.17 126.34,39.17 126.03,39.47 126.03,44.35 126.64,44.96 127.56,44.96 IC5.12
  Bottom 0.305: v132.13,36.42 v129.39,39.17
N$28
  Top 0.305: R36.1 131.98,49.84 125.88,49.84 123.75,47.7 122.53,47.7 IC5.1 122.53,47.55 122.53,46.48 IC5.2
N$29
  Top 0.305: R38.1 131.98,39.62 131.06,39.62 129.69,38.25 124.21,38.25 122.53,39.93 IC5.7 122.53,40.08 122.53,41.15 IC5.6
N$30  (via drill 0.25)
  Top 0.305: v148.59,39.78 151.03,39.78 R40.1 | v138.99,40.54 137.16,40.54 v136.7,41 | v129.54,41.15 127.71,41.15 IC5.9 127.71,41 127.71,40.08 IC5.8
  Bottom 0.305: v148.59,39.78 139.75,39.78 v138.99,40.54 | v136.7,41 130.91,41 130.76,41.15 v129.54,41.15
N$31  (via drill 0.25)
  Top 0.305: v147.07,53.65 150.72,49.99 151.03,49.99 R42.1 | v128.32,48.62 128.32,48.31 127.71,47.7 IC5.14 127.71,47.55 127.71,46.48 IC5.13
  Bottom 0.305: v147.07,53.65 147.07,62.48 145.09,64.47 144.17,64.47 v128.32,48.62
N$32
  Top 0.305: R37.1 132.13,54.25 132.13,51.82 R36.2 132.28,51.82 135.18,51.82 C21.1
N$33  (via drill 0.25)
  Top 0.305: R37.2 132.13,56.24 135.18,56.24 C22.1 135.33,56.08 135.64,56.08 v138.68,53.03 | v138.68,47.09 140.66,45.11 141.43,45.11 IC6.3
  Bottom 0.305: v138.68,53.03 v138.68,47.09
N$34
  Top 0.305: R39.1 132.13,44.04 132.13,41.6 R38.2 132.28,41.6 135.18,41.6 C23.1
N$35
  Top 0.305: R39.2 132.13,46.02 135.18,46.02 C24.1 135.33,46.02 135.64,46.02 138.99,42.67 141.43,42.67 IC6.5
N$36
  Top 0.305: R41.1 151.18,44.04 151.18,41.6 R40.2 151.33,41.6 154.23,41.6 C25.1
N$37
  Top 0.305: C26.1 154.23,46.02 151.18,46.02 R41.2 151.03,46.18 149.81,44.96 149.81,44.35 148.13,42.67 146.76,42.67 IC6.10
N$38
  Top 0.305: R43.1 151.18,54.25 151.18,51.82 R42.2 151.33,51.82 154.23,51.82 C27.1
N$39  (via drill 0.25)
  Top 0.305: C28.1 154.23,56.24 151.18,56.24 R43.2 151.03,56.08 150.72,56.08 v149.35,54.71 | v149.35,46.79 147.68,45.11 146.76,45.11 IC6.12
  Bottom 0.305: v149.35,54.71 v149.35,46.79
N$40
  Top 0.305: R48.1 46.33,73 41.91,73 U1.27
N$41
  Top 0.305: R45.1 148.28,77.72 148.28,77.11 151.64,73.76 151.64,70.41 IC7.11
N$42
  Top 0.305: R46.1 151.18,77.72 151.18,75.13 154.23,72.08 154.23,70.41 IC7.9
N$43
  Top 0.305: R47.1 154.08,77.72 154.08,73.15 155.45,71.78 155.45,70.41 IC7.8
SENS_MODE
  Top 0.254: JP3.1 6.4,90.07 14.48,81.99 14.48,77.72 16.46,75.74 U1.7
SPEED1+
  Top 0.508: R20.2 138.99,20.57 137.92,20.57 121.31,3.96 42.98,3.96 38.1,8.84 PL1.10
SPEED2+  (via drill 0.51)
  Top 0.508: v145.69,20.57 147.22,20.57 R22.2
  Bottom 0.508: v145.69,20.57 132.13,20.57 116.28,4.72 39.78,4.72 35.66,8.84 PL1.12
TORQUE1+  (via drill 0.51)
  Top 0.508: v120.85,20.57 122.53,20.57 R12.2 | v60.81,20.57 49.68,9.45 49.68,8.23 48.92,7.47 44.65,7.47 43.28,8.84 PL1.6
  Bottom 0.508: v60.81,20.57 v120.85,20.57
TORQUE2+  (via drill 0.51)
  Top 0.508: v129.08,20.57 130.76,20.57 R14.2
  Bottom 0.508: v129.08,20.57 122.53,20.57 112.47,10.52 59.13,10.52 55.32,6.71 42.82,6.71 PL1.8
VIN
  Top 0.305: RTD2.P1 72.24,95.4 72.24,74.98 71.17,73.91 71.17,64.92 72.54,63.55 RTD1.P1
VREF
  Top 0.305: 124.28,68.66 123.29,67.67 IC8.2 123.14,67.51 123.14,65.23 121.31,63.4 121.31,59.13 TP8.TP | 124.28,68.66 124.36,68.73 124.36,70.41 R44.1 | 124.28,68.66 124.66,68.28 134.42,68.28 135.18,69.04 135.18,69.8 IC9.12 | 135.48,74.37 135.48,76.2 133.5,78.18 123.29,78.18 IC3.2 123.29,78.33 121.61,80.01 121.61,82.14 C14.+ | 135.48,74.37 135.48,73.15 R10.2 | 135.48,74.37 142.19,74.37 142.95,73.61 142.95,70.26 140.97,68.28 140.36,68.28 137.92,65.84 137.92,64.77 IC9.5
  Bottom 0.305: IC8.2 123.29,67.67 123.29,78.03 IC3.2
VSPI_MISO  (via drill 0.25)
  Top 0.254: 47.93,74.75 57.91,64.77 61.27,64.77 62.48,63.55 RTD1.P5 | 47.93,74.75 47.85,74.83 46.48,74.83 R48.2 46.33,74.83 45.87,74.37 40.69,74.37 30.63,64.31 15.39,64.31 12.04,60.96 JP4.9 | v153.01,72.24 153.01,70.41 IC7.10 | 47.93,74.75 48.01,74.83 48.01,81.23 62.18,95.4 RTD2.P5
  Bottom 0.254: v153.01,72.24 153.01,73.3 127.86,98.45 77.11,98.45 72.69,94.03 63.7,94.03 62.33,95.4 RTD2.P5
VSPI_MOSI  (via drill 0.25)
  Top 0.254: JP4.8 6.25,63.55 4.42,65.38 4.42,69.04 5.18,69.8 10.97,69.8 11.43,69.34 22.25,69.34 41.15,88.24 41.91,88.24 U1.21 | v125.58,84.73 145.24,84.73 150.27,79.7 151.03,79.7 R46.2 | v64.77,62.03 65.99,62.03 87.17,40.84 87.17,40.39 90.37,37.19 92.96,37.19 97.99,32.16 98.3,32.16 IC4.13 | RTD2.P6 59.74,95.56 60.5,95.56 61.72,96.77 62.64,96.77 63.55,95.86 63.55,64.16 63.7,64.01 63.7,62.94 63.09,62.33 61.11,62.33 60.05,63.4 RTD1.P6
  Bottom 0.254: RTD2.P6 59.59,95.4 58.83,95.4 51.82,88.39 41.91,88.39 U1.21 | v125.58,84.73 89.76,84.73 70.41,65.38 63.86,65.38 | 63.86,65.38 61.87,65.38 60.05,63.55 RTD1.P6 | v64.77,62.03 63.86,62.94 63.86,65.38
VSPI_SCK  (via drill 0.25)
  Top 0.254: JP4.7 8.23,64.16 8.23,62.94 7.47,62.18 5.18,62.18 4.42,61.42 4.42,60.5 5.18,59.74 13.41,59.74 15.39,61.72 33.22,61.72 41.91,70.41 U1.28 | v145.54,79.7 148.13,79.7 R45.2 | IC4.15 93.42,32 93.42,31.55 95.1,29.87 100.89,29.87 101.96,30.94 101.96,33.22 97.08,38.1 97.08,38.86 96.16,39.78 89,39.78 65.38,63.4 65.08,63.4 RTD1.P4 | RTD2.P4 64.77,95.4 64.77,63.7 64.92,63.55 RTD1.P4 | v44.35,64.77 51.82,64.77 54.71,61.87 63.4,61.87 64.92,63.4 RTD1.P4
  Bottom 0.254: v145.54,79.7 129.39,79.7 124.82,84.28 90.07,84.28 70.71,64.92 66.45,64.92 65.08,63.55 RTD1.P4 | v44.35,64.77 44.35,67.97 41.91,70.41 U1.28

### Text on the board
tPlace: ISIS / BASSA FRIULANA | ISIS / MALIGNANI | DANIELI / BUTTRIO | HSPI_SCK | HSPI_MOSI | HSPI_MISO | !DRDY! | !HSPI_CS! | !PDWN! | VSPI_SCK | VSPI_MOSI | VSPI_MISO | !CS1_MAX31865! | !CS2_MAX31865! | !CS_MCP3204! | !CS_PGA0! | GND | GND | D.L.23
tNames: ANTENNA | RTD_2 | ESP32_DEVKIT_V4 | MOTHERBOARD | RTD_1 | SSD1306 | ISIS BASSA FRIULANA | PROGETTO ITEM - A.S.2022-23 | ACCEL_0 | ACCEL_1